# EAGLE design LilyPad_Prototyping_Board (EAGLE 7.4.0)

## Sheet 1 of 2
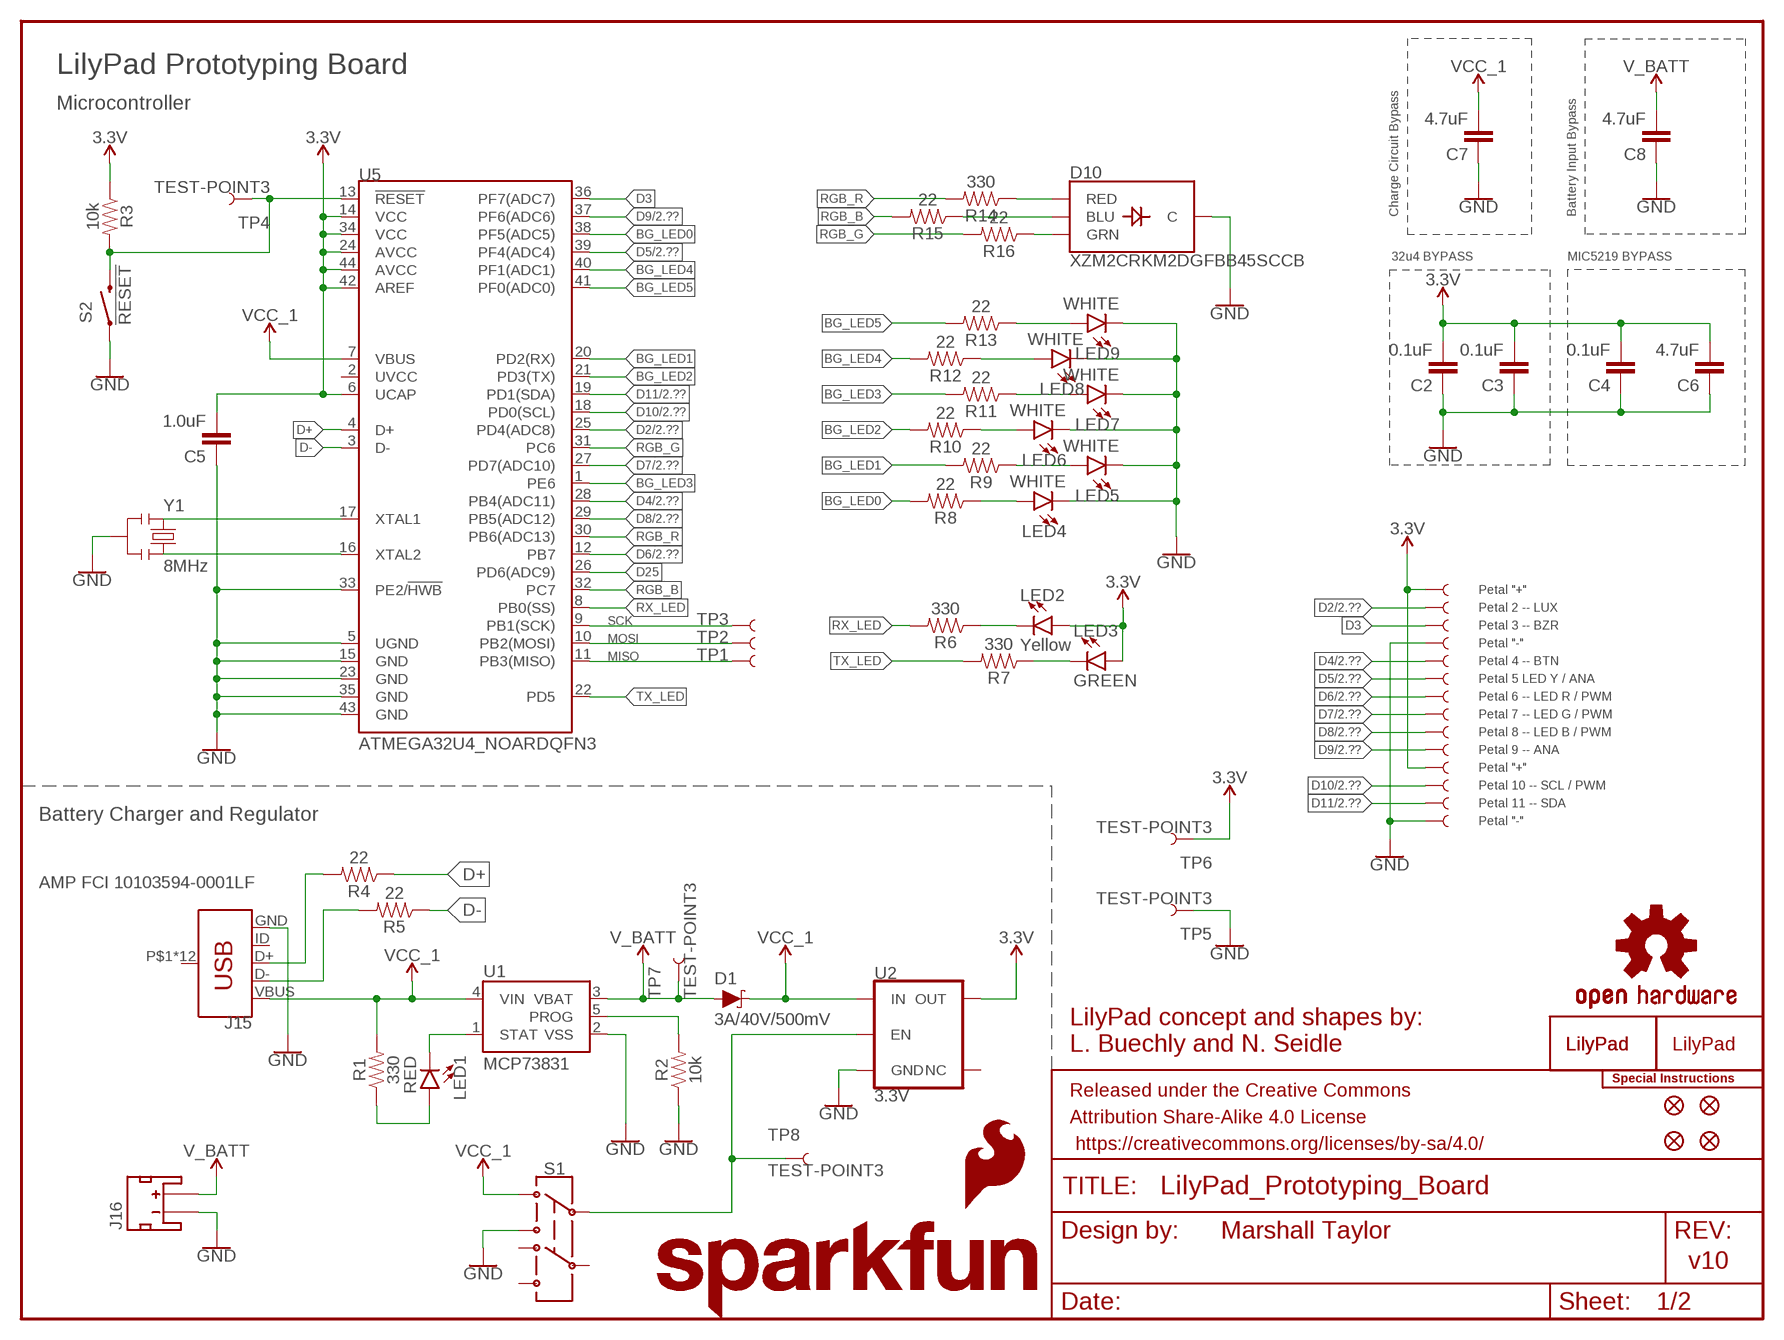
[diagram p0: schematic, sheet 1]

### Parts
C2  0.1uF  0.1UF-0402-16V-10%  [0402]
C3  0.1uF  0.1UF-0402-16V-10%  [0402]
C4  0.1uF  0.1UF-0402-16V-10%  [0402]
C5  1.0uF  1.0UF-0402-16V-10%  [0402]
C6  4.7uF  4.7UF0603  [0603]
C7  4.7uF  4.7UF0603  [0603]
C8  4.7uF  4.7UF0603  [0603]
D1  3A/40V/500mV  DIODE-SCHOTTKY-B340A  [SMA-DIODE]
D10  XZM2CRKM2DGFBB45SCCB  SUNLEDSMD1  [PLCC4SMDLED]
FRAME1  FRAME-LETTER  [CREATIVE_COMMONS]
J1  SEWTAP_LONG-2SIDE  [PETAL-LONG-1-2SIDE]
J2  SEWTAP_LONG-2SIDE  [PETAL-LONG-1-2SIDE]
J3  SEWTAP_LONG-2SIDE  [PETAL-LONG-1-2SIDE]
J4  SEWTAP_LONG-2SIDE  [PETAL-LONG-1-2SIDE]
J5  SEWTAP_LONG-2SIDE  [PETAL-LONG-1-2SIDE]
J6  SEWTAP_LONG-2SIDE  [PETAL-LONG-1-2SIDE]
J7  SEWTAP_LONG-2SIDE  [PETAL-LONG-1-2SIDE]
J8  SEWTAP_LONG-2SIDE  [PETAL-LONG-1-2SIDE]
J9  SEWTAP_LONG-2SIDE  [PETAL-LONG-1-2SIDE]
J10  SEWTAP_LONG-2SIDE  [PETAL-LONG-1-2SIDE]
J11  SEWTAP_LONG-2SIDE  [PETAL-LONG-1-2SIDE]
J12  SEWTAP_LONG-2SIDE  [PETAL-LONG-1-2SIDE]
J13  SEWTAP_LONG-2SIDE  [PETAL-LONG-1-2SIDE]
J14  SEWTAP_LONG-2SIDE  [PETAL-LONG-1-2SIDE]
J15  AMP FCI 10103594-0001LF  USB_MICRO-B_HALF_PTH  [USB-MICROB-PTH]
J16  JST_2MM_MALE  [JST-2-SMD]
JP2  FIDUCIALUFIDUCIAL  [MICRO-FIDUCIAL]
JP3  FIDUCIALUFIDUCIAL  [MICRO-FIDUCIAL]
JP11  FIDUCIALUFIDUCIAL  [MICRO-FIDUCIAL]
JP14  FIDUCIALUFIDUCIAL  [MICRO-FIDUCIAL]
LED1  RED  LED-RED0603  [LED-0603]
LED2  Yellow  LED-YELLOW0603  [LED-0603]
LED3  GREEN  LED-GREEN0603  [LED-0603]
LED4  WHITE  LED-WHITE0603  [LED-0603]
LED5  WHITE  LED-WHITE0603  [LED-0603]
LED6  WHITE  LED-WHITE0603  [LED-0603]
LED7  WHITE  LED-WHITE0603  [LED-0603]
LED8  WHITE  LED-WHITE0603  [LED-0603]
LED9  WHITE  LED-WHITE0603  [LED-0603]
LOGO1  SFE_LOGO_NAME.1_INCH  [SFE_LOGO_NAME_.1]
LOGO2  SFE_LOGO_FLAME.1EXP  [SFE_LOGO_FLAME_COPPER_EXPOSED_.1]
LOGO4  OSHW-LOGOS  [OSHW-LOGO-S]
LOGO5  OSHW-LOGOS  [OSHW-LOGO-S]
LOGO6  OSHW-LOGOS  [OSHW-LOGO-S]
R1  330  330OHM-0603-1/10W-1%  [0603]
R2  10k  10KOHM-0603-1/10W-1%  [0603]
R3  10k  10KOHM-0603-1/10W-1%  [0603]
R4  22  22OHM-0402-1/10W-1%  [0402]
R5  22  22OHM-0402-1/10W-1%  [0402]
R6  330  330OHM-0603-1/10W-1%  [0603]
R7  330  330OHM-0603-1/10W-1%  [0603]
R8  22  22OHM-0402-1/10W-1%  [0402]
R9  22  22OHM-0402-1/10W-1%  [0402]
R10  22  22OHM-0402-1/10W-1%  [0402]
R11  22  22OHM-0402-1/10W-1%  [0402]
R12  22  22OHM-0402-1/10W-1%  [0402]
R13  22  22OHM-0402-1/10W-1%  [0402]
R14  330  330OHM-0603-1/10W-1%  [0603]
R15  22  22OHM-0402-1/10W-1%  [0402]
R16  22  22OHM-0402-1/10W-1%  [0402]
S1  SWITCH-DPDT-SMD-AYZ0202  [SWITCH_DPDT_SMD_AYZ0202]
S2  !RESET  MOMENTARY-SWITCH-SPST-SMD-5.2-REDUNDANT  [TACTILE_SWITCH_SMD_5.2MM]
TP1  TEST-POINT3  [PAD.03X.03]
TP2  TEST-POINT3  [PAD.03X.03]
TP3  TEST-POINT3  [PAD.03X.03]
TP4  TEST-POINT3  [PAD.03X.03]
TP5  TEST-POINT3  [PAD.03X.03]
TP6  TEST-POINT3  [PAD.03X.03]
TP7  TEST-POINT3  [PAD.03X.03]
TP8  TEST-POINT3  [PAD.03X.03]
U1  MCP73831  [SOT23-5]
U2  3.3V  V_REG_AP2112K-3.3V  [SOT23-5]
U5  ATMEGA32U4_NOARDQFN3  [QFN-44-PAD_1:1-LESS_PASTE]
U$1  LILYLOGO_SHORT  [LILYPAD-WEARABLES_LOGO-LILYPAD]
U$13  LILYLOGO_SHORT  [LILYPAD-WEARABLES_LOGO-LILYPAD]
U$43  LILYLOGO_SHORT  [LILYPAD-WEARABLES_LOGO-LILYPAD]
U$44  SPECIAL_INSTRUCTIONS-ORDERING  [ORDERING_INSTRUCTIONS]
U$73  LILYLOGO_ABR  [LILYPAD-WEARABLES_LOGO-L]
Y1  8MHz  RESONATORSMD  [RESONATOR-SMD]

### Nets
3.3V: C2.2 C3.2 C4.2 C5.2 C6.2 J1.1 J11.1 LED2.A LED3.A R3.1 TP6.P$1 U2.5(OUT) U5.6(UCAP) U5.14(VCC) U5.24(AVCC) U5.34(VCC) U5.42(AREF) U5.44(AVCC) ; also sheet 2
BG_LED0: R8.2 U5.38(PF5(ADC5))
BG_LED1: R9.2 U5.20(PD2(RX))
BG_LED2: R10.2 U5.21(PD3(TX))
BG_LED3: R11.2 U5.1(PE6)
BG_LED4: R12.2 U5.40(PF1(ADC1))
BG_LED5: R13.2 U5.41(PF0(ADC0))
D2: J2.1 U5.25(PD4(ADC8)) ; also sheet 2
D3: J3.1 U5.36(PF7(ADC7)) ; also sheet 2
D4: J5.1 U5.28(PB4(ADC11)) ; also sheet 2
D5: J6.1 U5.39(PF4(ADC4)) ; also sheet 2
D6: J7.1 U5.12(PB7) ; also sheet 2
D7: J8.1 U5.27(PD7(ADC10)) ; also sheet 2
D8: J9.1 U5.29(PB5(ADC12)) ; also sheet 2
D9: J10.1 U5.37(PF6(ADC6)) ; also sheet 2
D10: J12.1 U5.18(PD0(SCL)) ; also sheet 2
D11: J13.1 U5.19(PD1(SDA)) ; also sheet 2
D25: U5.26(PD6(ADC9))
D+: R4.1 U5.4(D+)
D-: R5.1 U5.3(D-)
GND: C2.1 C3.1 C4.1 C5.1 C6.1 C7.1 C8.1 D10.4(C) J4.1 J14.1 J15.GND J16.1(-) LED4.C LED5.C LED6.C LED7.C LED8.C LED9.C R2.1 S1.3 S2.1 S2.2 TP5.P$1 U1.2(VSS) U2.2(GND) U5.5(UGND) U5.15(GND) U5.23(GND) U5.33(PE2/!HWB) U5.35(GND) U5.43(GND) Y1.2 ; also sheet 2
MISO: TP1.P$1 U5.11(PB3(MISO))
MOSI: TP2.P$1 U5.10(PB2(MOSI))
N$1: LED2.C R6.1
N$2: S1.2 TP8.P$1 U2.3(EN)
N$3: LED1.A R1.1
N$4: LED1.C U1.1(STAT)
N$5: U5.17(XTAL1) Y1.1
N$6: R2.2 U1.5(PROG)
N$7: U5.16(XTAL2) Y1.3
N$8: D10.2(GRN) R16.1
N$9: LED7.A R11.1
N$10: LED6.A R10.1
N$11: LED5.A R9.1
N$12: LED8.A R12.1
N$13: LED9.A R13.1
N$14: D10.3(BLU) R15.1
N$15: D10.1(RED) R14.1
N$18: LED4.A R8.1
N$19: J15.D- R5.2
N$20: J15.D+ R4.2
N$21: LED3.C R7.1
RESET: R3.2 S2.3 S2.4 TP4.P$1 U5.13(!RESET)
RGB_B: R15.2 U5.32(PC7)
RGB_G: R16.2 U5.31(PC6)
RGB_R: R14.2 U5.30(PB6(ADC13))
RX_LED: R6.2 U5.8(PB0(SS))
SCK: TP3.P$1 U5.9(PB1(SCK))
TX_LED: R7.2 U5.22(PD5)
V_BATT: C8.2 D1.A J16.2(+) TP7.P$1 U1.3(VBAT)
VCC_1: C7.2 D1.C J15.VBUS R1.2 S1.1 U1.4(VIN) U2.1(IN) U5.7(VBUS)
Unconnected: J15.ID J15.P$1(SHIELD) J15.P$2(SHIELD) J15.P$3(SHIELD) J15.P$4(SHIELD) J15.P$6(SHIELD) J15.P$8(SHIELD) J15.P$10(SHIELD) J15.P$12(SHIELD) J15.SHEILD2(SHIELD) J15.SHIELD J15.SHIELD3(SHIELD) J15.SHIELD4(SHIELD) J16.NC1(PAD1) J16.NC2(PAD2) S1.4 S1.5 S1.6 U2.4(NC) U5.2(UVCC)

### Notes on the sheet
- LilyPad Prototyping Board
- Microcontroller
- Charge Circuit Bypass | Battery Input Bypass
- 32u4 BYPASS | MIC5219 BYPASS
- Petal "+"
- Petal 2 -- LUX
- Petal 3 -- BZR
- Petal "-"
- Petal 4 -- BTN
- Petal 5 LED Y / ANA
- Petal 6 -- LED R / PWM
- Petal 7 -- LED G / PWM
- Petal 8 -- LED B / PWM
- Petal 9 -- ANA
- Petal "+"
- Petal 10 -- SCL / PWM
- Petal 11 -- SDA
- Battery Charger and Regulator | Petal "-"
- LilyPad concept and shapes by:
  L. Buechly and N. Seidle
- Marshall Taylor
- v10

## Sheet 2 of 2
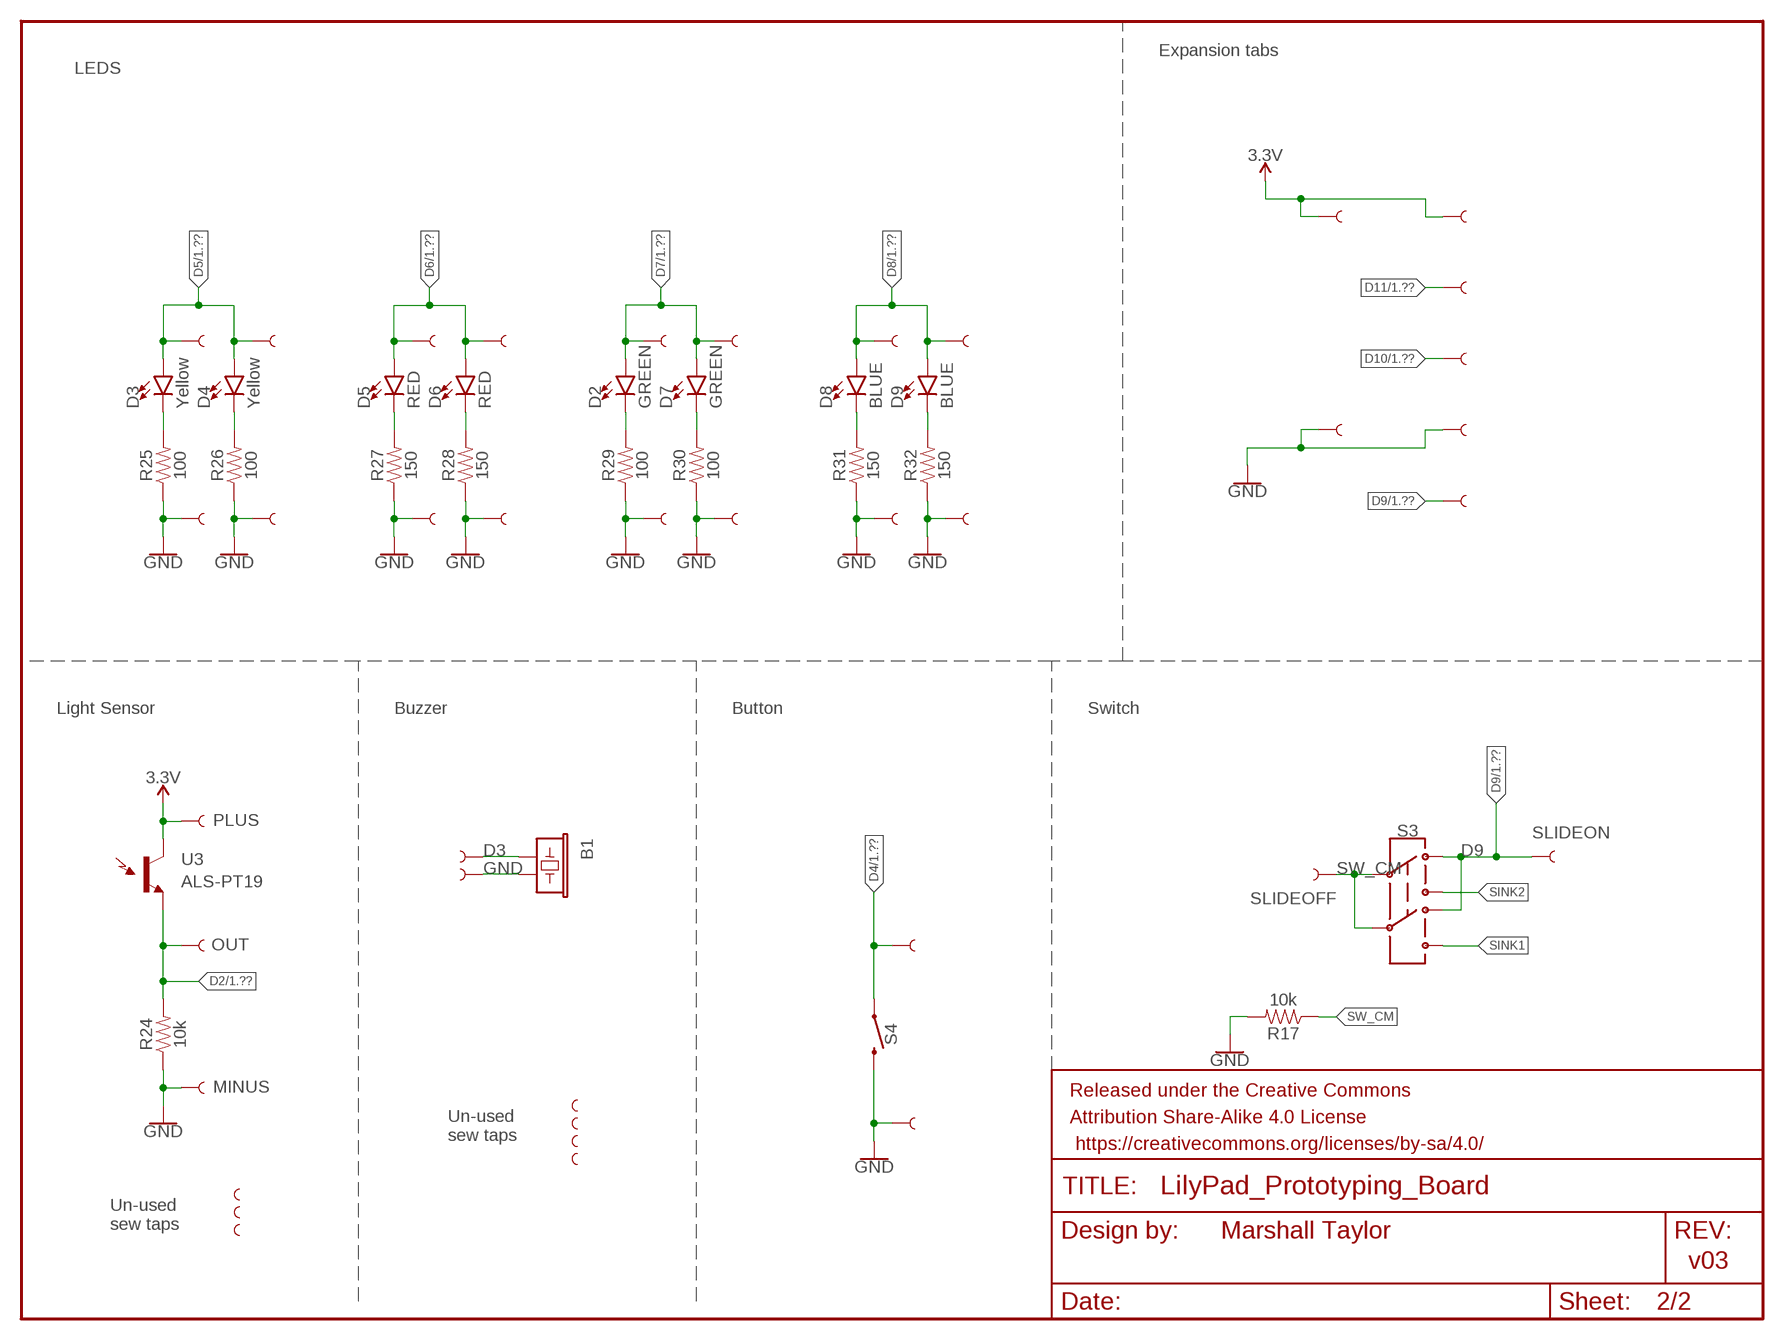
[diagram p1: schematic, sheet 2]

### Parts
B1  Buzzer  BUZZER-SMD  [BUZZER-CCV]
D2  GREEN  LED-GREENLILYPAD  [LED-1206]
D3  Yellow  LED-YELLOWLILYPAD  [LED-1206]
D4  Yellow  LED-YELLOWLILYPAD  [LED-1206]
D5  RED  LED-RED1206  [LED-1206]
D6  RED  LED-RED1206  [LED-1206]
D7  GREEN  LED-GREENLILYPAD  [LED-1206]
D8  BLUE  LED-BLUE1206  [LED-1206]
D9  BLUE  LED-BLUE1206  [LED-1206]
FRAME2  FRAME-LETTERNO_PACKAGE  [DUMMY]
JP1  SEWTAP_SMALL-2SIDE  [PETAL-SMALL-2SIDE]
JP4  SEWTAP_SMALL-2SIDE  [PETAL-SMALL-2SIDE]
JP5  SEWTAP_SMALL-2SIDE  [PETAL-SMALL-2SIDE]
JP6  SEWTAP_SMALL-2SIDE  [PETAL-SMALL-2SIDE]
JP7  SEWTAP_SMALL-2SIDE  [PETAL-SMALL-2SIDE]
JP8  SEWTAP_SMALL-2SIDE  [PETAL-SMALL-2SIDE]
JP9  SEWTAP_SMALL-2SIDE  [PETAL-SMALL-2SIDE]
JP10  SEWTAP_SMALL-2SIDE  [PETAL-SMALL-2SIDE]
JP12  SEWTAP_MEDIUM-2SIDE  [PETAL-MEDIUM-2SIDE]
JP13  SEWTAP_MEDIUM-2SIDE  [PETAL-MEDIUM-2SIDE]
JP20  SEWTAP_SMALL-2SIDE  [PETAL-SMALL-2SIDE]
JP21  SEWTAP_SMALL-2SIDE  [PETAL-SMALL-2SIDE]
JP22  SEWTAP_SMALL-2SIDE  [PETAL-SMALL-2SIDE]
JP23  SEWTAP_SMALL-2SIDE  [PETAL-SMALL-2SIDE]
JP24  SEWTAP_SMALL-2SIDE  [PETAL-SMALL-2SIDE]
JP25  SEWTAP_SMALL-2SIDE  [PETAL-SMALL-2SIDE]
JP26  SEWTAP_SMALL-2SIDE  [PETAL-SMALL-2SIDE]
JP27  SEWTAP_SMALL-2SIDE  [PETAL-SMALL-2SIDE]
R17  10k  10KOHM-0603-1/10W-1%  [0603]
R24  10k  10KOHM-0603-1/10W-1%  [0603]
R25  100  100OHM-0603-1/10W-1%  [0603]
R26  100  100OHM-0603-1/10W-1%  [0603]
R27  150  150OHM-0603-1/10W-1%  [0603]
R28  150  150OHM-0603-1/10W-1%  [0603]
R29  100  100OHM-0603-1/10W-1%  [0603]
R30  100  100OHM-0603-1/10W-1%  [0603]
R31  150  150OHM-0603-1/10W-1%  [0603]
R32  150  150OHM-0603-1/10W-1%  [0603]
S3  SWITCH-DPDT-SMD-AYZ0202  [SWITCH_DPDT_SMD_AYZ0202]
S4  MOMENTARY-SWITCH-SPST-SMD-5.2-REDUNDANT  [TACTILE_SWITCH_SMD_5.2MM]
SEWTAPLS+  PLUS  SEWTAP_SMALL-2SIDE  [PETAL-SMALL-2SIDE]
SEWTAPLS-  MINUS  SEWTAP_SMALL-2SIDE  [PETAL-SMALL-2SIDE]
SEWTAPLSOUT  OUT  SEWTAP_SMALL-2SIDE  [PETAL-SMALL-2SIDE]
SLIDEOFF  SEWTAP_MEDIUM-2SIDE  [PETAL-MEDIUM-2SIDE]
SLIDEON  SEWTAP_MEDIUM-2SIDE  [PETAL-MEDIUM-2SIDE]
ST1  SEWTAP-NOHOLE_SM_NH  [PETAL-SMALL-NOHOLE]
ST2  SEWTAP-NOHOLE_SM_NH  [PETAL-SMALL-NOHOLE]
ST3  SEWTAP-NOHOLE_SM_NH  [PETAL-SMALL-NOHOLE]
U3  ALS-PT19  LIGHT_SENSORALS  [ALS-PT19]
U$35  SEWTAP-NOHOLE_SM_NH  [PETAL-SMALL-NOHOLE]
U$36  SEWTAP-NOHOLE_SM_NH  [PETAL-SMALL-NOHOLE]
U$37  SEWTAP-NOHOLE_SM_NH  [PETAL-SMALL-NOHOLE]
U$38  SEWTAP_SMALL-2SIDE  [PETAL-SMALL-2SIDE]
U$39  SEWTAP_SMALL-2SIDE  [PETAL-SMALL-2SIDE]
U$40  SEWTAP-NOHOLE_SM_NH  [PETAL-SMALL-NOHOLE]
U$41  GATOR_HOLE_PAIR  [GATOR_HOLES]
U$42  GATOR_HOLE_PAIR  [GATOR_HOLES]
U$51/SDA  GATOR_HOLE_PAIR  [GATOR_HOLES]
U$52/SCL  GATOR_HOLE_PAIR  [GATOR_HOLES]
U$52/SCL1  GATOR_HOLE_PAIR  [GATOR_HOLES]
U$53  GATOR_HOLE_PAIR  [GATOR_HOLES]
U$54  GATOR_HOLE_PAIR  [GATOR_HOLES]

### Nets
3.3V: SEWTAPLS+.1 U3.C(C1) U$41.P$1 U$41.P$2 U$42.P$1 U$42.P$2 ; also sheet 1
D2: R24.2 SEWTAPLSOUT.1 U3.E(E1) ; also sheet 1
D3: B1.+ U$39.1 ; also sheet 1
D4: JP12.1 S4.1 S4.2 ; also sheet 1
D5: D3.A D4.A JP20.1 JP22.1 ; also sheet 1
D6: D5.A D6.A JP24.1 JP26.1 ; also sheet 1
D7: D2.A D7.A JP7.1 JP8.1 ; also sheet 1
D8: D8.A D9.A JP9.1 JP10.1 ; also sheet 1
D9: S3.1 S3.4 SLIDEON.1 U$52/SCL1.P$1 U$52/SCL1.P$2 ; also sheet 1
D10: U$52/SCL.P$1 U$52/SCL.P$2 ; also sheet 1
D11: U$51/SDA.P$1 U$51/SDA.P$2 ; also sheet 1
GND: B1.- JP1.1 JP4.1 JP5.1 JP6.1 JP13.1 JP21.1 JP23.1 JP25.1 JP27.1 R17.2 R24.1 R25.1 R26.1 R27.1 R28.1 R29.1 R30.1 R31.1 R32.1 S4.3 S4.4 SEWTAPLS-.1 U$38.1 U$53.P$1 U$53.P$2 U$54.P$1 U$54.P$2 ; also sheet 1
N$41: D3.C R25.2
N$42: D4.C R26.2
N$43: D5.C R27.2
N$44: D6.C R28.2
SINK1: S3.6
SINK2: S3.3
SW_CM: R17.1 S3.2 S3.5 SLIDEOFF.1
X003: D2.C R29.2
X004: D7.C R30.2
X005: D8.C R31.2
X006: D9.C R32.2

### Notes on the sheet
- Expansion tabs
- LEDS
- Light Sensor | Buzzer | Button | Switch
- Un-used
  sew taps
- Un-used
  sew taps
- Marshall Taylor
- v03

## Library data of the parts
B1 = SparkFun-Electromechanical:BUZZER: Buzzer Small round buzzers that operate around the audible 2kHz range. You can use these as speakers to create simple music or user interfaces. Variant Overview: PTH - Mini Speaker - PC Mount 12mm 2.048kHz PTH_KIT - Mini Speaker - PC Mount 12mm 2.048kHz KIT simplifies soldering by adding stop mask to one side of the pads. PTH_NO_SILK - Mini Speaker - PC Mount 12mm 2.048kHz No silkscreen indicator of buzzer outline. PTH_KIT_NO_SILK - Mini Speaker - PC Mount 12mm 2.048kHz KIT package w/o silkscreen SMD - Buzzer Audio Magnetic (CCV-084B16) SMD buzzer used on, e.g. the LilyPad Buzzer and RFID USB Reader. SMD_KIT - Buzzer Audio Magnetic (CCV-084B16) SMD Buzzer with elongated pins to make soldering easier. Used on the SparkFun Simon Says - Surface Mount Soldering Kit.; PROD_ID: COMP-08568
C2-C4 = SparkFun-Capacitors:0.1UF: 0.1µF ceramic capacitors A capacitor is a passive two-terminal electrical component used to store electrical energy temporarily in an electric field.; PROD_ID: CAP-12416
C5 = SparkFun-Capacitors:1.0UF: 1µF ceramic capacitors A capacitor is a passive two-terminal electrical component used to store electrical energy temporarily in an electric field.; PROD_ID: CAP-12417
C6-C8 = SparkFun-Capacitors:4.7UF: 4.7µF ceramic capacitors A capacitor is a passive two-terminal electrical component used to store electrical energy temporarily in an electric field.; PROD_ID: CAP-08280
D1 = SparkFun-DiscreteSemi:DIODE-SCHOTTKY: Schottky diode A Schottky diode is a semiconductor diode which has a low forward voltage drop and a very fast switching action.; PROD_ID: DIO-09886
D2 D7 = SparkFun-LED:LED-GREEN: Green SMD LED Used in manufacturing of various products at SparkFun Packages: 0603 - SMD 0603 package [Product Link] <http://www.futureelectronics.com/en/technologies/semiconductors/optoelectronics/leds/Pages/9894312-LTST-C190GKT.aspx?CrossPart=HSMG-C190&IM=0> LilyPad 1206 - SMD1206 LilyPad package [Product Link] <http://www.futureelectronics.com/en/Technologies/Product.aspx?ProductID=IN150NGHARVATEKCORPORATION2049943&IM=0> 1206 - SMD1206 package [Product Link] <http://www.futureelectronics.com/en/technologies/semiconductors/optoelectronics/leds/Pages/8315665-LTST-C150KGKT.aspx?IM=0> 1206 Bottom Mount -SMD 1206 Bottom Mount [Product Link] <http://www.digikey.com/product-detail/en/lite-on-inc/LTST-C230KGKT/160-1456-1-ND/386854> SparkFun Products: Pro Mini 328 -5V <https://www.sparkfun.com/products/821> RedBoard <https://www.sparkfun.com/products/12757> MP3 Trigger <https://www.sparkfun.com/products/13720> Makey Makey <https://www.sparkfun.com/products/11076>; PROD_ID: DIO-09910
D3 D4 = SparkFun-LED:LED-YELLOW: Yellow SMD LED Used in manufacturing several products at SparkFun. Packages: 0603 - SMD 0603 package[Product Link] <http://www.kingbrightusa.com/product.asp?catalog_name=LED&product_id=APT1608SYCK> 0603 -SMART - SMART SMD 0603 package (more efficient/more expensive) [Product Link] <http://www.osram-os.com/osram_os/en/products/product-catalog/led-light-emitting-diodes/smartled-0603/ly-l29k/index.jsp> LilyPad - SMD1206 package[Product Datasheet] <https://www.sparkfun.com/datasheets/DevTools/LilyPad/Q150YUS4.pdf> SparkFun Products: Blynk Board <https://www.sparkfun.com/products/13794> IOIO-OTG <https://www.sparkfun.com/products/13613> XBee Explorer Serial <https://www.sparkfun.com/products/13225>; PROD_ID: DIO-09909
D5 D6 = SparkFun-LED:LED-RED: Red SMD LED Used in manufacturing of most products at SparkFun Packages: 0603 - SMD 0603 package [Product Link] <http://docs.avagotech.com/docs/AV02-0551EN> 0603 SMART - SMD 0603 SMART package ( more efficient and expensive)[Product Link] <http://www.osram-os.com/Graphics/XPic2/00077099_0.pdf> 1206 - SMD1206 package [Product Link] <https://www.sparkfun.com/datasheets/DevTools/LilyPad/Q150OVS4.pdff> SparkFun Products: Pro Mini 328 -5V <https://www.sparkfun.com/products/821> RedBoard <https://www.sparkfun.com/products/12757> IOIO-OTG <https://www.sparkfun.com/products/13613>; PROD_ID: DIO-09912
D8 D9 = SparkFun-LED:LED-BLUE: Blue SMD LED Used in manufacturing of various products at SparkFun Packages: 0603 - SMD 0603 package [Product Link] <http://www.digikey.com/product-detail/en/SMLE12BC7TT86/511-1589-2-ND/1641808> 1206 - SMD1206 package [Product Link] <http://www.digikey.com/product-detail/en/lite-on-inc/LTST-C150TBKT/160-1643-1-ND/573584> SparkFun Products: ESP8266 Thing-Dev Board <https://www.sparkfun.com/products/13711> RedBoard <https://www.sparkfun.com/products/12757>; PROD_ID: DIO-09911
D10 = newLilypadParts:SUNLED: LED-RGB Common Cathode XZM2CRKM2DGFBB45SCCB Packages: PLCC4 SparkFun Products: Lilypad Prototyping Board <[https://www.sparkfun.com/products/9264]>; PROD_ID: DIO-13722
FRAME1 = SparkFun-Aesthetics:FRAME-LETTER: Schematic Frame - Letter Standard 8.5x11 US Letter frame
FRAME2 = SparkFun-Aesthetics:FRAME-LETTER: Schematic Frame - Letter Standard 8.5x11 US Letter frame; DESIGNER: Nobody; VERSION: v01
J1-J14 JP1 JP4-JP10 JP12 JP13 JP20-JP27 SEWTAPLS+ SEWTAPLS- SEWTAPLSOUT SLIDEOFF SLIDEON U$38 U$39 = LilyPad-Wearables:SEWTAP: SparkFun LilyPad Sew Taps Sewable connection points for LilyPad Boards SparkFun Products: LilyPad Arduino 328 Main Board <https://www.sparkfun.com/products/13342> LilyTiny <https://www.sparkfun.com/products/10899> LilyPad Power Supply <https://www.sparkfun.com/products/11259>
J15 = SparkFun-Connectors:USB_MICRO-B: USB Type Micro-B Connector Male/female and PTH/SMT variants SparkFun Products: SparkFun microB USB Breakout <https://www.sparkfun.com/products/12035> SparkFun USB microB Plug Breakout <https://www.sparkfun.com/products/10031> SparkFun ESP8266 Thing <https://www.sparkfun.com/products/13231>; PROD_ID: CONN-13711
J16 = SparkFun-Connectors:JST_2MM_MALE: JST 2MM MALE RA CONNECTOR Two pin, compact surface mount connector. Commonly used as a battery input connection point. We really like the solid locking feeling and high current rating on these small connectors. We use these all the time as battery connectors. Mates to single-cell LiPo batteries. Here is the connector we sell at SparkFun: JST Right Angle Connector - White (PRT-08612) Datasheet It was used on these SparkFun products: SparkFun MOSFET Power Controller (PRT-11214) SparkFun Battery Babysitter - LiPo Battery Manager (PRT-13777) And many, many others that required a lipo battery connection.; PROD_ID: CONN-11443; SF_ID: PRT-08612
JP2 JP3 JP11 JP14 = SparkFun:FIDUCIAL: Fiducial Alignment Points Various fiducial points for machine vision alignment.
LED1 = SparkFun-LED:LED-RED: Red SMD LED Used in manufacturing of most products at SparkFun Packages: 0603 - SMD 0603 package [Product Link] <http://docs.avagotech.com/docs/AV02-0551EN> 0603 SMART - SMD 0603 SMART package ( more efficient and expensive)[Product Link] <http://www.osram-os.com/Graphics/XPic2/00077099_0.pdf> 1206 - SMD1206 package [Product Link] <https://www.sparkfun.com/datasheets/DevTools/LilyPad/Q150OVS4.pdff> SparkFun Products: Pro Mini 328 -5V <https://www.sparkfun.com/products/821> RedBoard <https://www.sparkfun.com/products/12757> IOIO-OTG <https://www.sparkfun.com/products/13613>; PROD_ID: DIO-00819
LED2 = SparkFun-LED:LED-YELLOW: Yellow SMD LED Used in manufacturing several products at SparkFun. Packages: 0603 - SMD 0603 package[Product Link] <http://www.kingbrightusa.com/product.asp?catalog_name=LED&product_id=APT1608SYCK> 0603 -SMART - SMART SMD 0603 package (more efficient/more expensive) [Product Link] <http://www.osram-os.com/osram_os/en/products/product-catalog/led-light-emitting-diodes/smartled-0603/ly-l29k/index.jsp> LilyPad - SMD1206 package[Product Datasheet] <https://www.sparkfun.com/datasheets/DevTools/LilyPad/Q150YUS4.pdf> SparkFun Products: Blynk Board <https://www.sparkfun.com/products/13794> IOIO-OTG <https://www.sparkfun.com/products/13613> XBee Explorer Serial <https://www.sparkfun.com/products/13225>; PROD_ID: DIO-09003
LED3 = SparkFun-LED:LED-GREEN: Green SMD LED Used in manufacturing of various products at SparkFun Packages: 0603 - SMD 0603 package [Product Link] <http://www.futureelectronics.com/en/technologies/semiconductors/optoelectronics/leds/Pages/9894312-LTST-C190GKT.aspx?CrossPart=HSMG-C190&IM=0> LilyPad 1206 - SMD1206 LilyPad package [Product Link] <http://www.futureelectronics.com/en/Technologies/Product.aspx?ProductID=IN150NGHARVATEKCORPORATION2049943&IM=0> 1206 - SMD1206 package [Product Link] <http://www.futureelectronics.com/en/technologies/semiconductors/optoelectronics/leds/Pages/8315665-LTST-C150KGKT.aspx?IM=0> 1206 Bottom Mount -SMD 1206 Bottom Mount [Product Link] <http://www.digikey.com/product-detail/en/lite-on-inc/LTST-C230KGKT/160-1456-1-ND/386854> SparkFun Products: Pro Mini 328 -5V <https://www.sparkfun.com/products/821> RedBoard <https://www.sparkfun.com/products/12757> MP3 Trigger <https://www.sparkfun.com/products/13720> Makey Makey <https://www.sparkfun.com/products/11076>; PROD_ID: DIO-00819
LED4-LED9 = SparkFun-LED:LED-WHITE: White SMD LED Used in manufacturing several products at SparkFun. Packages: 0603 - Bright White SMD 0603 package[Product Link] <http://www.kingbrightusa.com/product.asp?catalog_name=LED&product_id=APT1608QWF/D> 1206 - Bright White SMD1206 package [Product Link] <http://www.kingbrightusa.com/product.asp?catalog_name=LED&product_id=APT3216QWF/D> SparkFun Products: Blackberry Trackballer Breakout <https://www.sparkfun.com/products/13169> Digital SandBox <https://www.sparkfun.com/products/12651>; PROD_ID: DIO-09004
LOGO1 = SparkFun-Aesthetics:SFE_LOGO_NAME: SparkFun Font Logo This is the SparkFun name logo. The logo on the schematic will always be the same size; the package variant is the height of the flame part of the logo (or the height the flame would be, if it were drawn). Default layer for the logo on the board is tSilk.
LOGO2 = SparkFun-Aesthetics:SFE_LOGO_FLAME: SparkFun Flame Logo This is the SparkFun flame logo. The logo on the schematic will always be the same size; the package variant is the height of the flame. Default layer for the logo on the board is tSilk.
LOGO4-LOGO6 = SparkFun-Aesthetics:OSHW-LOGO: Open-Source Hardware (OSHW) Logo This logo indicates the piece of hardware it is found on incorporates a OSHW license and/or adheres to the definition of open source hardware found here: http://freedomdefined.org/OSHW
R1 R6 R7 R14 = SparkFun-Resistors:330OHM: 330Ω resistor A resistor is a passive two-terminal electrical component that implements electrical resistance as a circuit element. Resistors act to reduce current flow, and, at the same time, act to lower voltage levels within circuits. - Wikipedia; PROD_ID: RES-00818
R2 R3 R17 R24 = SparkFun-Resistors:10KOHM: 10kΩ resistor A resistor is a passive two-terminal electrical component that implements electrical resistance as a circuit element. Resistors act to reduce current flow, and, at the same time, act to lower voltage levels within circuits. - Wikipedia; PROD_ID: RES-00824
R4 R5 R8-R13 R15 R16 = SparkFun-Resistors:22OHM: 22Ω resistor A resistor is a passive two-terminal electrical component that implements electrical resistance as a circuit element. Resistors act to reduce current flow, and, at the same time, act to lower voltage levels within circuits. - Wikipedia; PROD_ID: RES-12427
R25 R26 R29 R30 = SparkFun-Resistors:100OHM: 100Ω resistor A resistor is a passive two-terminal electrical component that implements electrical resistance as a circuit element. Resistors act to reduce current flow, and, at the same time, act to lower voltage levels within circuits. - Wikipedia; PROD_ID: RES-07863
R27 R28 R31 R32 = SparkFun-Resistors:150OHM: 150Ω resistor A resistor is a passive two-terminal electrical component that implements electrical resistance as a circuit element. Resistors act to reduce current flow, and, at the same time, act to lower voltage levels within circuits. - Wikipedia; PROD_ID: RES-11028
S1 S3 = SparkFun-Switches:SWITCH-DPDT: Double-Pole, Double-Throw (DPDT) Switch Double-pole, double-throw switches. Variant Overview PTH-GPI-152-3013 Used on SparkFun Geiger Counter SMD-AY0202 Surface Mount DPDT Switch (COM-00597) Used on e.g. LilyPad Arduino USB - ATmega32U4 Board; PROD_ID: SWCH-08179; SF_SKU: COM-00597
S2 S4 = SparkFun-Switches:MOMENTARY-SWITCH-SPST: Momentary Switch (Pushbutton) - SPST Normally-open (NO) SPST momentary switches (buttons, pushbuttons). Variants PTH-12MM - 12mm square, through-hole Momentary Pushbutton Switch - 12mm Square (COM-09190) PTH-6.0MM, PTH-6.0MM-KIT - 6.0mm square, through-hole Mini Pushbutton Switch (COM-00097) KIT package intended for soldering kit's - only one side of pads' copper is exposed. PTH-RIGHT-ANGLE-KIT - Right-angle, through-hole Right Angle Tactile Button - Used on SparkFun BigTime Watch Kit SMD-12MM - 12mm square, surface-mount Tactile Button - SMD (12mm) (COM-12993) Used on SparkFun PicoBoard SMD-4.5MM - 4.5mm Square Trackball Switch Used on SparkFun Blackberry Trackballer Breakout SMD-4.6MMX2.8MM - 4.60mm x 2.80mm, surface mount Used on SparkFun SAMD21 Mini Breakout SMD-5.2MM, SMD-5.2-REDUNDANT - 5.2mm square, surface-mount Mini Pushbutton Switch - SMD (COM-08720) Used on Arduino Pro Mini REDUNDANT package connects both switch circuits together SMD-6.0X3.5MM - 6.0 x 3.5mm, surface mount Momentary Reset Switch SMD (COM-08229) SMD-6.2MM-TALL - 6.2mm square, surface mount Tactile Button - SMD (6mm) Used on SparkFun Digital Sandbox SMD-RIGHT-ANGLE - Right-angle, surface mount Used on SparkFun Block for Intel® Edison - Arduino; PROD_ID: SWCH-08247; SF_SKU: COM-08720
ST1-ST3 U$35-U$37 U$40 = LilyPad-Wearables:SEWTAP-NOHOLE: SparkFun LilyPad Sew Taps without Holes Petals used for PCB aesthetics. No connection points for circuits, and no hole available for sewing. SparkFun Products: LilyPad Vibe Board <https://www.sparkfun.com/products/11008> LilyPad Accelerometer <https://www.sparkfun.com/products/9267> LilyPad Buzzer <https://www.sparkfun.com/products/8463>
TP1-TP8 = SparkFun-Connectors:TEST-POINT: SparkFun Test Points Bare copper test points for troubleshooting or In-Circuit-Testing. These are used by our Production team for verifying production board runs using pogo-pins on test beds. SparkFun Products: SparkFun LSM9DS1 Breakout <https://www.sparkfun.com/products/13284> SparkFun PSOC <https://www.sparkfun.com/products/13714> SparkFun Load Cell Amplifier <https://www.sparkfun.com/products/13879>
U1 = SparkFun-PowerIC:MCP73831: Miniature single cell, fully integrated Li-Ion, Li-polymer charge management controller http://ww1.microchip.com/downloads/en/DeviceDoc/21984a.pdf; PROD_ID: IC-09995
U2 = SparkFun-IC-Power:V_REG_AP2112: AP2112 - 600mA CMOS LDO Regulator w/ Enable The AP2112 is CMOS process low dropout linear regulator with enable function, the regulator delivers a guaranteed 600mA (min.) continuous load current. Features Output Voltage Accuracy: ±1.5% Output Current: 600mA (Min.) Foldback Short Current Protection: 50mA Enable Function to Turn ON/OFF VOUT Low Dropout Voltage (3.3V): 250mV (Typ.) @IOUT=600mA Excellent Load Regulation: 0.2%/A (Typ.) Excellent Line Regulation: 0.02%/V (Typ.) Low Quiescent Current: 55μA (Typ.) Low Standby Current: 0.01μA (Typ.) Low Output Noise: 50μVRMS PSRR: 100Hz -65dB, 1kHz -65dB OTSD Protection Stable with 1.0μF Flexible Cap: Ceramic, Tantalum and Aluminum Electrolytic Operation Temperature Range: -40°C to 85°C ESD: MM 400V, HBM 4000V; PROD_ID: VREG-12457
U3 = SparkFun-Sensors:LIGHT_SENSOR: Ambient Light Sensors - Phototransistors Low cost ambient light sensors, consisting of a phototransistor in miniature SMD packages. Output voltage varies with light intensity. SparkFun Products ALS-PT19 Light Sensor (SEN-12566) Ambient Light Sensor - TEMT6000 (SEN-08348) SparkFun Ambient Light Sensor Breakout - TEMT60000 (SEN-08688); PROD_ID: IC-11836; SF_ID: SEN-12566
U5 = newLilypadParts:ATMEGA32U4_NOARD: Atmel MCU, 32KByte Atmel 44-pin 8-bit Microcontroller with 32KBytes of ISP Flash and USB Controller Datasheet SparkFun Products LilyPad Arduino USB - ATmega32U4 Board (DEV-12049) Pro Micro - 5V/16MHz (DEV-12640) Pro Micro - 3.3V/8MHz (DEV-12587) Fio v3 - ATmega32U4 (DEV-11520) Qduino Mini (DEV-13614) Makey Makey - Standard Kit (WIG-11511) Makey Makey Deluxe Kit (WIG-11519)
U$1 U$13 U$43 = newLilypadParts:LILYLOGO_SHORT
U$41 U$42 U$51/SDA U$52/SCL U$52/SCL1 U$53 U$54 = newLilypadParts:GATOR_HOLE_PAIR
U$44 = SparkFun-Aesthetics:SPECIAL_INSTRUCTIONS: Special Ordering/Production Instructions Alert Symbol for special PCB ordering instructions or unique production process warnings. Ordering Instructions Production Instructions Types of information that should be added to box: Copper weight Soldermask color Silk color PCB thickness Number of layers PCB Standard: 1.6mm FR4 1 oz copper immersion silver plating red soldermask white silkscreen Types of information that should be added to box: Special wash requirements Depaneling instructions Humidification Glue curing Default text settings: 0.07 inch 9% ratio 50% line distance
U$73 = newLilypadParts:LILYLOGO_ABR
Y1 = SparkFun-FreqCtrl:RESONATOR: Resonator Small SMD resonator. This is the itty bitty 10/20MHz resonators with built in caps. CSTCE10M0G55 and CSTCE20M0V53. Footprint has been reviewed closely but hasn't been tested yet.; PROD_ID: XTAL-08895

## Board
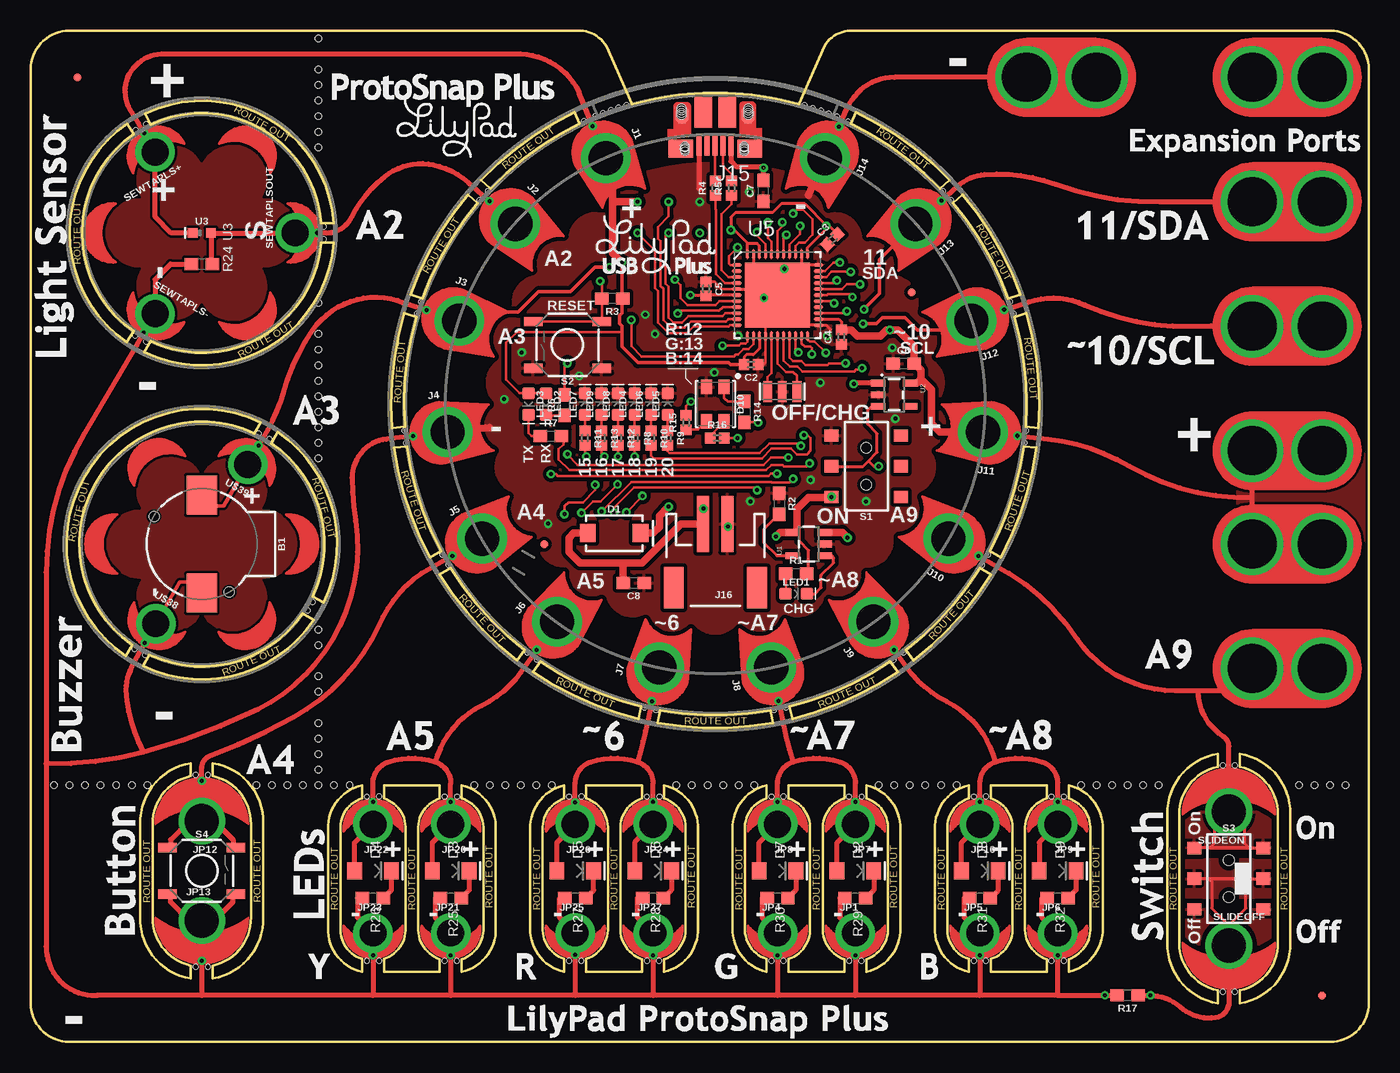
[diagram p2: board, top side]
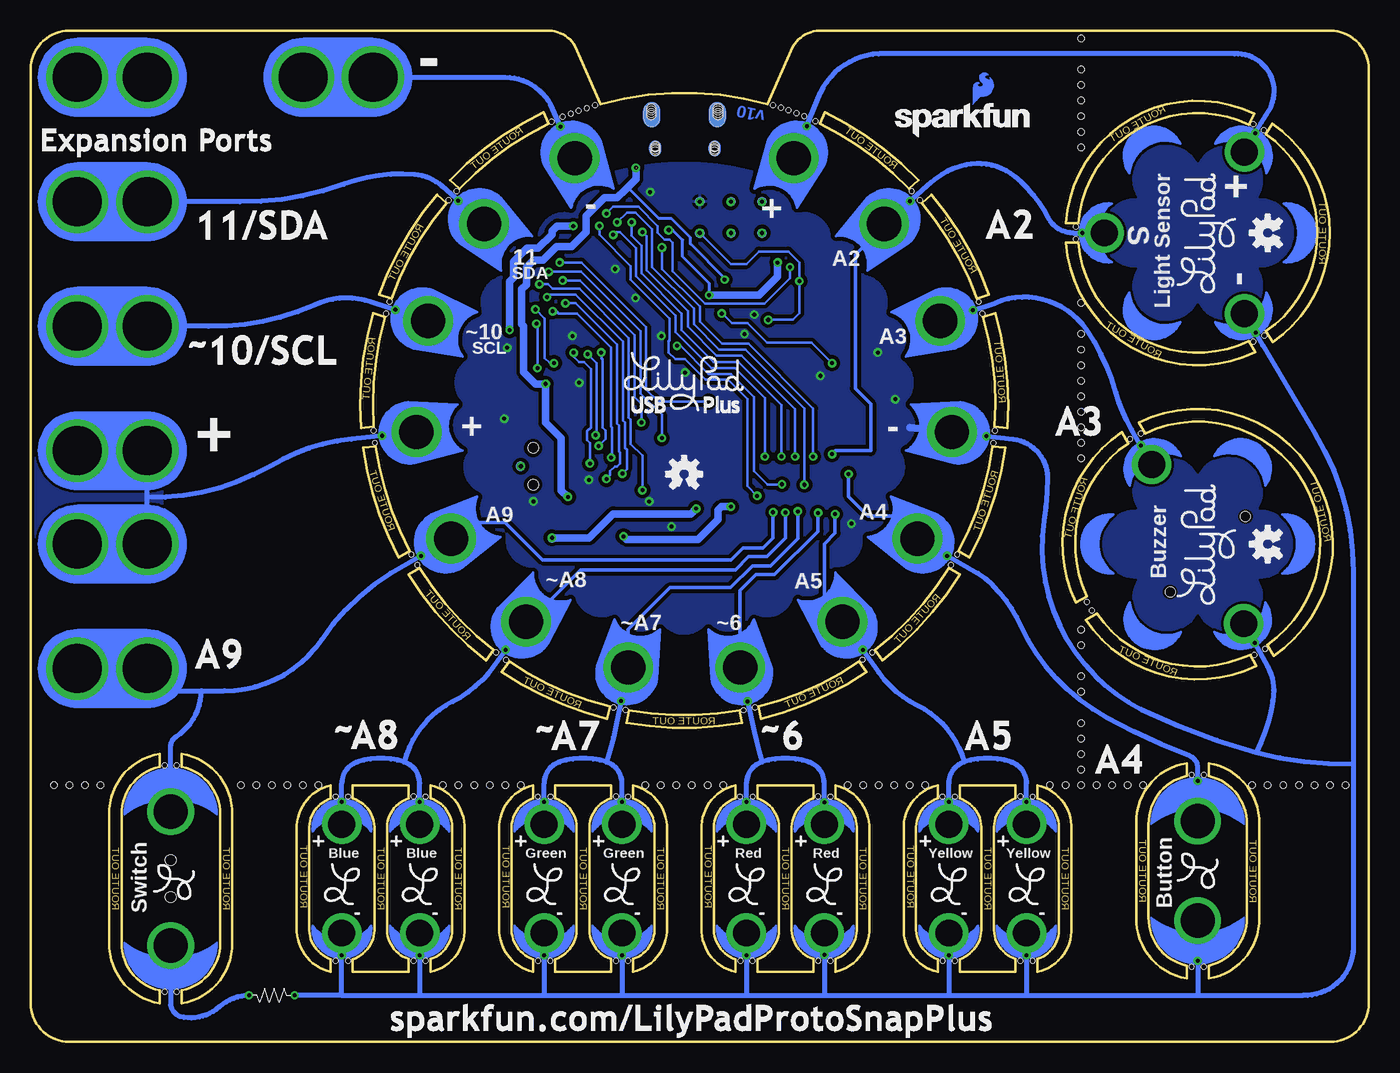
[diagram p3: board, bottom side, seen from below]

Size 109.22 x 82.55 mm. Coordinates in mm from the lower left corner, seen from the top.
Outline: 234 segments
Copper layers (1*16): Top 0.035mm / dielectric 1.5mm / Bottom 0.035mm
Design rules "SparkFun-2-layer-TIGHT *": minimum track width 7mil, minimum drill 15mil, track to track 8mil, track to pad 8mil, pad to pad 8mil, via to via 8mil, smd to smd 8mil, copper to edge 7mil, drill to drill 7mil, minimum pad ring 7mil, minimum via ring 7mil, stop-mask expansion 4mil, vias tented up to drill 25mil, thermal gap 10mil
Holes 0.38 mm at 23.92,66.54 23.93,65.54 8.57,74.41 9.44,74.91 9.42,57.16 8.55,57.67 14.47,6.13 13.47,6.13 14.47,21.81 13.47,21.81 33.77,20.03 34.81,20.03 33.79,6.64 34.79,6.64 27.44,20.03 28.44,20.03 27.44,6.64 28.44,6.64 8.47,32.07 9.33,31.58 18.6,49.68 19.48,49.21 22.6,35.22 23,35.92 37.32,69.44 36.64,68.71 31.85,60.41 31.54,59.46 30.54,49.92 30.63,48.9 34.1,38.92 33.6,39.79 40.54,31.78 41.33,31.2 50.09,27.3 51.04,27.08 60.67,27.09 61.65,27.3 70.42,31.19 71.23,31.79 77.66,38.92 78.15,39.8 81.12,48.91 81.23,49.91 80.21,59.47 79.92,60.42 74.45,69.45 75.12,68.7 66.7,75.1 65.79,75.51 65.13,75.76 64.49,76.01 63.16,76.45 63.83,76.23 45.16,75.15 46.09,75.57 46.73,75.82 47.36,76.05 48,76.27 48.64,76.47 98.29,4.1 97.29,4.1 97.29,22.57 98.29,22.57 50.28,20.03 51.32,20.03 50.3,6.64 51.3,6.64 43.95,20.03 44.95,20.03 43.95,6.64 44.95,6.64 66.79,20.03 67.83,20.03 66.81,6.64 67.81,6.64 60.46,20.03 61.46,20.03 60.46,6.64 61.46,6.64 83.3,20.03 84.34,20.03 83.32,6.64 84.32,6.64 76.97,20.03 77.97,20.03 76.97,6.64 77.97,6.64
Holes 0.51 mm at 23.5,24.77 23.5,23.5 23.5,22.23 23.5,20.96 38.73,20.96 40.01,20.96 55.25,20.96 56.52,20.96 71.75,20.96 73.03,20.96 88.27,20.96 20.96,20.96 22.23,20.96 18.41,20.96 19.69,20.96 89.53,20.96 90.81,20.96 92.08,20.96 103.5,20.96 104.78,20.96 106.05,20.96 107.31,20.96 9.53,20.96 8.26,20.96 6.98,20.96 5.72,20.96 4.45,20.96 23.5,26.04 23.5,28.57 23.5,29.84 23.5,32.39 23.5,33.66 23.5,47.62 23.5,48.9 23.5,50.16 23.5,52.7 23.5,53.98 23.5,51.44 23.5,55.24 23.5,56.52 23.5,57.78 23.5,73.03 23.5,74.3 23.5,75.56 23.5,76.84 23.5,78.11 23.5,79.38 75.56,20.96 70.48,20.96 87,20.96 85.72,20.96 74.3,20.96 69.22,20.96 59.05,20.96 57.79,20.96 53.98,20.96 52.71,20.96 42.55,20.96 41.28,20.96 37.47,20.96 36.2,20.96 26.04,20.96 24.77,20.96 3.18,20.96 1.91,20.96 23.5,60.33 23.5,81.91
tRestrict: area 19,60.7 to 24.1,71.4; area 14,69 to 23.1,76.4; area 4.8,69 to 14,76.4; area 3.8,60.7 to 8.9,71.1; area 4.8,55.4 to 14,63.1; area 14,55.4 to 23.1,63.1; area 48.8,71.5 to 62.9,77.2; area 14,43.6 to 23.1,51; area 19,35.3 to 24.1,46; area 14,30 to 23.1,37.7; area 4.8,30 to 14,37.7; area 3.8,35.3 to 8.9,45.7; 1 more areas; 1 lines
bRestrict: area 48.8,71.5 to 62.9,77.2; area 19,60.7 to 24.1,71.4; area 14,69 to 23.1,76.4; area 4.8,69 to 14,76.4; area 3.8,60.7 to 8.9,71.1; area 4.8,55.4 to 14,63.1; area 14,55.4 to 23.1,63.1; area 14,43.6 to 23.1,51; area 19,35.3 to 24.1,46; area 14,30 to 23.1,37.7; area 4.8,30 to 14,37.7; area 3.8,35.3 to 8.9,45.7; 1 more areas; 1 lines

### Footprints (pad centres in the part's own frame; a part is rotated, then mirrored left to right if it is on the bottom)
BUZZER-CCV = smd 3.2 x 2.5: + 4,0; - -4,0 | hole 0.8: -3.9,-2.25; 2.25,3.9
0402 = smd 0.85 x 0.9: 1 -0.58,0; 2 0.58,0
0603 = smd 1.1 x 1: 1 -0.85,0; 2 0.85,0
SMA-DIODE = smd 1.27 x 1.47: A -2.15,0; C 2.15,0
LED-1206 = smd 1.2 x 1.4: A -1.5,0; C 1.5,0
PLCC4SMDLED = smd 1.2 x 0.9: 1 -1.4,0.725; 2 1.4,0.725; 3 1.4,-0.725; 4 -1.4,-0.725
PETAL-LONG-1-2SIDE = drill 2.794 pad 4.064: 1 0.03,0
USB-MICROB-PTH = smd 0.4 x 1.75: D+ 0.031,1.331; D- -0.619,1.331; GND 1.331,1.331; ID 0.681,1.331; VBUS -1.269,1.331 | smd 1.4 x 2.1 bottom: P$1 2.701,-1.142; P$3 -2.659,-1.144 | smd 1 x 1.3: P$2 2.487,1.594; P$6 -2.368,1.604 | smd 1 x 1.3 bottom: P$4 -2.368,1.604; P$10 2.481,1.598 | smd 1.1 x 1.5: P$8 2.701,-1.142; P$12 -2.659,-1.144 | smd 2 x 1.46: SHEILD2 2.831,1.606; SHIELD -2.794,1.606 | smd 1.425 x 2.5: SHIELD3 -0.979,-1.349; SHIELD4 0.996,-1.352 | hole 0.7: -2.693,-1.134; -2.693,-1.3; -2.694,-1.499; -2.694,-1.664; 2.768,-1.134; 2.767,-1.303; 2.766,-1.496; 2.766,-1.664 | hole 0.66: -2.359,1.821; -2.349,1.691; -2.359,1.541; -2.354,1.432; 2.481,1.821; 2.491,1.691; 2.481,1.541; 2.486,1.432
JST-2-SMD = smd 1 x 4.6: 1 -1,-3.7; 2 1,-3.7 | smd 1.6 x 3.4: NC1 -3.4,1.5; NC2 3.4,1.5
PETAL-SMALL-2SIDE = drill 2.2: 1 0,0
MICRO-FIDUCIAL = smd 0.635 x 0.635: 1 0,0
PETAL-MEDIUM-2SIDE = drill 2.794: 1 0,-0.254
LED-0603 = smd 1 x 1: A -0.877,0; C 0.877,0
SWITCH_DPDT_SMD_AYZ0202 = smd 1 x 1.15: 1 -2.5,2.825; 2 0,2.825; 3 2.5,2.825; 4 -2.5,-2.825; 5 0,-2.825; 6 2.5,-2.825 | hole 0.85: 1.5,0; -1.5,0
TACTILE_SWITCH_SMD_5.2MM = smd 1.524 x 0.762: 1 -2.794,1.905; 2 2.794,1.905; 3 -2.794,-1.905; 4 2.794,-1.905
PAD.03X.03 = smd 0.762 x 0.762: P$1 0,0
SOT23-5 = smd 0.55 x 1.2: 1 -0.95,-1.3; 2 0,-1.3; 3 0.95,-1.3; 4 0.95,1.3; 5 -0.95,1.3
ALS-PT19 = smd 0.8 x 0.8: C -0.75,0; E 0.75,0
QFN-44-PAD_1:1-LESS_PASTE = smd 0.8 x 0.3: 1 -3.337,2.458; 2 -3.337,1.958; 3 -3.337,1.479; 4 -3.337,0.979; 5 -3.337,0.5; 6 -3.337,0; 7 -3.337,-0.5; 8 -3.337,-0.979; 9 -3.337,-1.479; 10 -3.337,-1.958; 11 -3.337,-2.458; 23 3.337,-2.458; 24 3.337,-1.958; 25 3.337,-1.479; 26 3.337,-0.979; 27 3.337,-0.5; 28 3.337,0; 29 3.337,0.5; 30 3.337,0.979; 31 3.337,1.479; 32 3.337,1.958; 33 3.337,2.458 | smd 0.3 x 0.8: 12 -2.458,-3.337; 13 -1.958,-3.337; 14 -1.479,-3.337; 15 -0.979,-3.337; 16 -0.5,-3.337; 17 0,-3.337; 18 0.5,-3.337; 19 0.979,-3.337; 20 1.479,-3.337; 21 1.958,-3.337; 22 2.458,-3.337; 34 2.458,3.337; 35 1.958,3.337; 36 1.479,3.337; 37 0.979,3.337; 38 0.5,3.337; 39 0,3.337; 40 -0.5,3.337; 41 -0.979,3.337; 42 -1.479,3.337; 43 -1.958,3.337; 44 -2.458,3.337 | smd 5.3 x 5.3: EPAD 0,0
GATOR_HOLES = drill 4 pad 5.08: P$1 0,0; P$2 5.715,0
RESONATOR-SMD = smd 0.7 x 1.7: 1 -1.2,0; 2 0,0; 3 1.2,0

### Placement (x,y rotation side)
B1  13.97,40.64 90 top
C2  58.8,55.29 180 top
C3  65.44,65.52 45 top
C4  66.17,57.53 90 top
C5  55.12,61.47 270 top
C6  71.25,55.37 0 top
C7  59.82,69.47 90 top
C8  49.21,37.47 180 top
D1  47.63,41.53 0 top
D2  67.31,13.97 0 top
D3  34.29,13.97 0 top
D4  27.94,13.97 0 top
D5  44.45,13.97 0 top
D6  50.8,13.97 0 top
D7  60.96,13.97 0 top
D8  77.47,13.97 0 top
D9  83.82,13.97 0 top
D10  55.88,52.07 270 top
FRAME1  20.7,-11.43 0 top  (outside the outline)
FRAME2  5.08,-16.51 0 top  (outside the outline)
J1  46.93,72.17 294 top
J2  39.53,66.79 318 top
J3  34.96,58.87 342 top
J4  34,49.77 6 top
J5  36.83,41.07 30 top
J6  42.95,34.27 54 top
J7  51.31,30.55 78 top
J8  60.45,30.55 102 top
J9  68.81,34.27 126 top
J10  74.93,41.07 150 top
J11  77.76,49.77 174 top
J12  76.8,58.87 198 top
J13  72.23,66.79 222 top
J14  64.83,72.17 246 top
J15  55.88,74.53 180 top
J16  55.88,38.58 180 top
JP1  67.31,8.89 0 top
JP2  41.91,40.64 0 top
JP3  71.9,61.2 0 top
JP4  60.96,8.89 0 top
JP5  77.47,8.89 0 top
JP6  83.82,8.89 0 top
JP7  67.31,17.78 180 top
JP8  60.96,17.78 180 top
JP9  83.82,17.78 180 top
JP10  77.47,17.78 180 top
JP11  105.41,3.81 0 top
JP12  13.97,17.78 180 top
JP13  13.97,10.16 0 top
JP14  3.81,78.74 0 top
JP20  34.29,17.78 180 top
JP21  34.29,8.89 0 top
JP22  27.94,17.78 180 top
JP23  27.94,8.89 0 top
JP24  50.8,17.78 180 top
JP25  44.45,8.89 0 top
JP26  44.45,17.78 180 top
JP27  50.8,8.89 0 top
L001  [LOGO-L]  77.47,12.86 0 bottom
L002  [LOGO-L]  67.31,12.86 0 bottom
L003  [LOGO-L]  83.82,12.86 0 bottom
L004  [LOGO-L]  60.96,12.86 0 bottom
LED1  62.48,36.58 0 top
LED2  42.07,52.07 270 top
LED3  40.64,52.07 270 top
LED4  49.29,52.07 90 top
LED5  51.99,52.07 90 top
LED6  50.64,52.07 90 top
LED7  45.24,52.07 90 top
LED8  47.94,52.07 90 top
LED9  46.59,52.07 90 top
LOGO1  39.13,73.34 0 bottom
LOGO2  32.62,76.2 0 bottom
LOGO4  8.26,66.04 90 bottom
LOGO5  8.26,40.64 90 bottom
LOGO6  55.88,46.36 0 bottom
R1  62.48,38.23 0 top
R2  61.09,43.94 270 top
R3  47.47,60.68 180 top
R4  55.9,69.69 90 top
R5  57.21,69.69 90 top
R6  43.58,51.99 90 top
R7  42.47,49.45 0 top
R8  49.29,49.29 270 top
R9  51.99,49.29 270 top
R10  50.64,49.29 270 top
R11  45.24,49.29 270 top
R12  47.94,49.29 270 top
R13  46.59,49.29 270 top
R14  58.26,51.44 270 top
R15  53.5,50.56 90 top
R16  56.04,49.29 0 top
R17  89.53,3.81 180 top
R24  13.97,63.5 0 top
R25  34.29,11.75 0 top
R26  27.94,11.75 0 top
R27  44.45,11.75 0 top
R28  50.8,11.75 0 top
R29  67.31,11.75 0 top
R30  60.96,11.75 0 top
R31  77.47,11.75 0 top
R32  83.82,11.75 0 top
S1  68.2,46.99 90 top
S2  43.82,56.9 180 top
S3  97.79,13.34 270 top
S4  13.97,13.97 0 top
SEWTAPLS+  10.16,72.64 210 top
SEWTAPLS-  10.16,59.44 330 top
SEWTAPLSOUT  21.59,66.04 90 top
SLIDEOFF  97.79,8.13 0 top
SLIDEON  97.79,18.54 180 top
ST1  6.35,66.04 270 top
ST2  17.78,59.44 30 top
ST3  17.78,72.64 150 top
TP1  49.53,66.04 0 bottom
TP2  52.07,68.58 0 bottom
TP3  52.07,66.04 0 bottom
TP4  54.61,66.04 0 bottom
TP5  54.61,68.58 0 bottom
TP6  49.53,68.58 0 bottom
TP7  66.67,41.16 0 bottom
TP8  69.22,46.99 0 bottom
U1  63.5,40.64 90 top
U2  70.48,52.83 270 top
U3  13.97,66.04 0 top
U5  60.96,60.96 0 top
U$1  55.88,54.25 0 bottom
U$3  [PETAL_PAD_OFF]  46.93,72.17 294 top
U$5  LILYLOGO_SHORT  [LILYPAD-WEARABLES_LOGO-LILYPAD]  13.61,66.04 90 bottom
U$6  LILYLOGO_SHORT  [LILYPAD-WEARABLES_LOGO-LILYPAD]  13.61,40.64 90 bottom
U$7  [PETAL_SPACE_OFF]  46.93,72.17 294 top
U$8  [PETAL_SPACE_OFF]  74.93,41.07 150 top
U$9  [PETAL_PAD_OFF]  74.93,41.07 150 top
U$10  [PETAL_SPACE_OFF]  76.8,58.87 198 top
U$11  [PETAL_PAD_OFF]  76.8,58.87 198 top
U$12  [PETAL_SPACE_OFF]  77.76,49.77 174 top
U$13  51.06,65.39 0 top
U$15  [PETAL_PAD_OFF]  77.76,49.77 174 top
U$16  [PETAL_SPACE_OFF]  72.23,66.79 222 top
U$17  [PETAL_PAD_OFF]  72.23,66.79 222 top
U$18  [PETAL_SPACE_OFF]  51.31,30.55 78 top
U$19  [PETAL_PAD_OFF]  42.95,34.27 54 top
U$20  [PETAL_SPACE_OFF]  42.95,34.27 54 top
U$21  [PETAL_PAD_OFF]  51.31,30.55 78 top
U$22  [PETAL_SPACE_OFF]  60.45,30.55 102 top
U$23  [PETAL_PAD_OFF]  60.45,30.55 102 top
U$24  [PETAL_SPACE_OFF]  68.81,34.27 126 top
U$25  [PETAL_PAD_OFF]  68.81,34.27 126 top
U$26  [PETAL_SPACE_OFF]  39.53,66.79 318 top
U$27  [PETAL_PAD_OFF]  39.53,66.79 318 top
U$28  [PETAL_SPACE_OFF]  34.96,58.87 342 top
U$29  [PETAL_PAD_OFF]  34.96,58.87 342 top
U$30  [PETAL_SPACE_OFF]  34,49.77 6 top
U$31  [PETAL_PAD_OFF]  34,49.77 6 top
U$32  [PETAL_SPACE_OFF]  36.83,41.07 30 top
U$33  [PETAL_PAD_OFF]  36.83,41.07 30 top
U$34  [PETAL_PAD_OFF]  64.83,72.17 246 top
U$35  10.22,47.14 210 top
U$36  21.47,40.64 90 top
U$37  17.72,34.14 30 top
U$38  10.22,34.14 330 top
U$39  17.72,47.13 150 top
U$40  6.47,40.64 270 top
U$41  99.69,40.64 0 top
U$42  99.69,48.26 0 top
U$43  34.8,74.93 0 top
U$44  3.81,-17.78 0 top  (outside the outline)
U$45  [LOGO-L]  13.97,13.97 90 bottom
U$46  [LOGO-L]  50.8,12.86 0 bottom
U$48  [LOGO-L]  44.45,12.86 0 bottom
U$49  [LOGO-L]  34.29,12.86 0 bottom
U$50  [LOGO-L]  27.94,12.86 0 bottom
U$51  [ROUTE_TICKS]  46.93,72.17 294 top
U$51/SDA  99.69,68.58 0 top
U$52  [ROUTE_TICKS]  39.53,66.79 318 top
U$52/SCL  99.69,58.42 0 top
U$52/SCL1  99.69,30.48 0 top
U$53  81.28,78.74 0 top
U$54  99.69,78.74 0 top
U$55  [ROUTE_TICKS]  34.96,58.87 342 top
U$56  [ROUTE_TICKS]  34,49.77 6 top
U$57  [ROUTE_TICKS]  36.83,41.07 30 top
U$58  [ROUTE_TICKS]  42.95,34.27 54 top
U$59  [ROUTE_TICKS]  51.31,30.55 78 top
U$60  [ROUTE_TICKS]  60.45,30.55 102 top
U$61  [ROUTE_TICKS]  68.81,34.27 126 top
U$62  [ROUTE_TICKS]  36.83,41.07 150 top
U$63  [ROUTE_TICKS]  77.76,49.77 174 top
U$64  [ROUTE_TICKS]  74.93,41.07 150 top
U$65  [ROUTE_TICKS]  76.8,58.87 198 top
U$66  [ROUTE_TICKS]  64.83,72.17 246 top
U$67  [ROUTE_TICKS]  72.23,66.79 222 top
U$68  [ROUTE_TICKS]  17.26,46.34 240 top
U$70  [ROUTE_TICKS]  10.67,34.92 60 top
U$71  [ROUTE_TICKS]  19.69,37.37 150 top
U$73  97.51,13.06 90 bottom
Y1  61.34,53.09 180 top

### Tracks (layer width: path | path; a pad name or v marks a point on that pad's centre or on a via)
3.3V  (via drill 0.33, 0.33 pad 0.51, 0.38)
  Top 0.203: 48.26,57.94 39.69,57.94 38.81,57.07 38.81,54.05 39.92,52.95 LED3.A | LED3.A | LED3.A LED2.A | R3.1 48.32,60.9 48.26,60.96
  Top 0.254: C4.2 66.17,58.8 65.97,59 U5.24 | C4.2 | C2.2 58.22,55.9 58.42,56.1 58.98,56.1 59.48,56.61 U5.14 | 58.54,65.17 59.29,65.17 59.48,64.98 U5.42 | 58.54,65.17 57.43,66.28 v57.15,66.28 57.15,67.31 57.55,67.71 60.56,67.71 61.28,68.42 63.18,68.42 64.93,66.67 v64.93,66.6 | v64.93,66.6 64.93,66.36 63.42,64.85 U5.34 | C3.2 65.18,66.6 v64.93,66.6 | U5.44 58.5,65.13 58.54,65.17 | U5.6 55.19,60.96 C5.2 55.05,60.96 v53.85,60.96
  Top 0.305: J1.1 47.5,71.59 | C2.2 57.1,55.29 56.95,55.44 49.57,55.44 48.26,56.75 48.26,57.94 48.26,58.42 48.06,58.62 48.06,59.29 48.26,59.49 48.26,60.96 v48.26,63.63
  Top 0.406: J1.1 44.77,77.47 arc63 40.01,80.64 10.95,80.64 arc127 8.26,75.88 8.79,75.03 SEWTAPLS+.1 10.16,67.37 11.49,66.04 U3.C | U$41.P$1 99.69,44.45 | 99.69,44.45 U$42.P$1 U$42.P$2 | J11.1 83.03,49.21 arc-25 89.69,46.99 arc31 99.69,44.45
  Top 0.61: U2.5 72.32,53.78 72.64,54.1 | 72.64,54.1 72.64,54.83 C6.2 72.1,56.81 70.79,58.11 v70.14,58.11 69.86,58.11 69.37,57.63 67.47,57.63 66.98,58.11 C4.2 | 47.5,71.59 47.5,68.58 | 47.5,68.58 47.5,64.39 v48.26,63.63 | TP6.P$1 47.5,68.58 | J11.1 74.21,49.77 73.5,50.48 73.5,53.24 72.64,54.1
  Bottom 0.254: v53.85,60.96 53.85,61.93 56.01,64.09 56.01,65.45 56.83,66.28 v57.15,66.28
  Bottom 0.406: U$41.P$1 99.69,44.45 | 99.69,44.45 U$42.P$1 U$42.P$2 | 99.69,44.45 arc-31 89.69,46.99 arc25 83.03,49.21 J11.1 v80.54,49.48 | v45.87,74.75 J1.1 44.77,77.47 arc63 40.01,80.64 10.95,80.64 arc127 8.26,75.88 8.79,75.03 SEWTAPLS+.1 v9.27,74.19
  Bottom 0.61: v48.26,63.63 48.26,62.48 49.78,60.96 v53.85,60.96 | v70.14,58.11 70.14,62.07 69.8,62.41 69.8,63.69 68.69,64.8 67.79,64.8 66.67,65.91 66.67,66.17 66.25,66.6 v64.93,66.6
  other vias: 49.53,68.58
  pour Top: 99.69,51.44 109.22,51.44 109.22,37.47 99.69,37.47 99.69,39.37 98.43,40.64 98.43,48.26 99.69,49.53
  pour Bottom: 99.69,51.44 109.22,51.44 109.22,37.47 99.69,37.47 99.69,39.37 98.43,40.64 98.43,48.26 99.69,49.53
BG_LED0  (via drill 0.33)
  Top 0.203: R8.2 v49.29,47.78 | U5.38 61.46,65.67 v61.67,65.88
  Bottom 0.203: v61.67,65.88 61.44,66.12 61.12,66.12 59.81,64.81 59.81,62.51 56.59,59.29 56.59,57.94 53.66,55.01 51.75,55.01 49.29,52.55 v49.29,47.78
BG_LED1  (via drill 0.33)
  Top 0.203: R9.2 51.99,48.22 52.15,48.06 59.49,48.06 60.29,48.86 62.67,48.86 v62.87,48.66 | 62.46,56.48 v62.66,56.28 62.44,56.5 U5.20
  Bottom 0.203: v62.66,56.28 62.63,56.24 62.63,55.8 62.55,55.72 62.55,50.16 62.31,49.93 62.31,49.21 v62.87,48.66
BG_LED2  (via drill 0.33)
  Top 0.203: 63.75,56.26 v63.75,56.13 63.75,56.66 63.66,56.75 63.18,56.75 62.92,57.02 U5.21 | R10.2 50.64,47.86 50.88,47.62 59.69,47.62 60.48,48.42 62.07,48.42 62.55,47.94 63.34,47.94 63.66,48.26 63.66,49.29 63.42,49.53 v63.1,49.53
  Bottom 0.203: v63.75,56.13 63.02,55.4 63.02,49.61 v63.1,49.53
BG_LED3  (via drill 0.33, 0.38)
  Top 0.203: R11.2 45.24,47.9 v45.36,47.78 | 57.71,64.82 v57.71,64.85 56.99,64.14 56.99,63.54 57.11,63.42 U5.1
  Bottom 0.203: v57.71,64.85 57.71,63.1 54.61,60.01 54.61,58.82 52.78,56.99 50.64,56.99 45.36,51.71 v45.36,47.78
BG_LED4  (via drill 0.33)
  Top 0.203: v60.17,66.91 60.17,65.6 60.46,65.31 U5.40 | R12.2 v47.94,47.78
  Bottom 0.203: v60.17,66.91 60.17,65.8 59.37,65.01 59.37,62.75 56.09,59.47 56.09,58.12 53.48,55.52 51.45,55.52 47.94,52.01 v47.94,47.78
BG_LED5  (via drill 0.33)
  Top 0.203: v59.29,66.12 59.29,65.8 59.98,65.11 U5.41 | R13.2 46.59,48.02 v46.83,47.78
  Bottom 0.203: v46.83,47.78 46.83,51.66 51.2,56.02 53.23,56.02 55.58,58.37 55.58,59.64 58.94,63 58.94,65.76 v59.29,66.12
D2  (via drill 0.33, 0.33 pad 0.51)
  Top 0.203: v61.83,47.7 60.4,47.7 59.81,47.11 44.65,47.11 43.82,47.94 v43.82,47.98 | U5.25 66.45,59.48 v66.61,59.64
  Top 0.406: R24.2 14.72,63.5 U3.E SEWTAPLSOUT.1 v23.39,66.04 24.13,66.04 arc63 26.19,67.31 arc-24 28.89,70.64 arc-51 32.86,71.6 arc-30 35.72,70.17 J2.1
  Bottom 0.203: v66.61,59.64 66.31,59.64 66.12,59.45 64.61,59.45 61.83,56.67 61.83,50.24 61.75,50.16 61.75,47.78 v61.83,47.7
  Bottom 0.305: v43.82,47.98 43.54,48.26 40.64,48.26 40.64,52.07 41.91,53.34 41.91,64.25 39.55,66.61 J2.1
  Bottom 0.406: SEWTAPLSOUT.1 v23.39,66.04 24.13,66.04 arc63 26.19,67.31 arc-24 28.89,70.64 arc-51 32.86,71.6 arc-30 35.72,70.17 39.18,67.1 | 39.18,67.1 J2.1 | v37.44,68.63 39.18,67.1
D3  (via drill 0.33, 0.33 pad 0.51)
  Top 0.203: 37.59,59.56 36.89,58.86 J3.1 | v62.23,67.63 62.55,67.94 63.02,67.94 63.82,67.15 63.82,65.88 63.18,65.25 62.71,65.25 62.44,64.98 U5.36
  Top 0.305: v47.24,63.25 46.07,63.25 44.09,61.26 41.47,61.26 39.77,59.56 37.59,59.56 | U$39.1 15.75,43.73 14.88,43.73 | 13.97,43.73 14.88,43.73 | 13.86,44.75 B1.+ 14.88,43.73
  Top 0.406: J3.1 30.48,60.33 arc78 23.02,58.1 arc19 20.64,53.02 arc-14 19.37,50.01 U$39.1
  Bottom 0.203: v47.24,63.25 47.24,62.36 49.32,60.28 54.19,60.28 56.83,62.93 56.83,65.25 57.07,65.48 57.47,65.48 58.04,66.06 58.04,66.61 59.61,68.18 61.67,68.18 v62.23,67.63
  Bottom 0.406: J3.1 34.49,59.02 | 34.49,59.02 30.48,60.33 arc78 23.02,58.1 arc19 20.64,53.02 arc-14 19.37,50.01 U$39.1 v18.59,48.69 | v32.31,59.74 34.49,59.02
D4  (via drill 0.33, 0.33 pad 0.51)
  Top 0.203: v67.07,60.8 66.83,61.04 65.09,61.04 65.01,60.96 U5.28 | v42.47,46.36 42.86,46.36 43.02,46.2 60.21,46.2 60.4,46.4 v60.92,46.4
  Top 0.406: JP12.1 v13.97,21.31 13.97,22.38 arc-67 14.61,23.34 arc8 21.43,26.51 arc36 28.42,33.97 arc-32 31.91,38.26 J5.1 | JP12.1 12.95,18.03 11.43,16.51 11.43,16.13 S4.1 | JP12.1 14.99,18.03 16.51,16.51 16.51,16.13 S4.2
  Bottom 0.203: v67.07,60.8 66.87,61 64.73,61 60.88,57.15 60.88,50.72 60.72,50.56 60.72,48.5 60.56,48.34 60.56,46.75 v60.92,46.4
  Bottom 0.305: J5.1 38.71,42.94 40.88,42.94 42.47,44.53 v42.47,46.36
  Bottom 0.406: 13.97,19.3 v13.97,21.31 | JP12.1 13.97,22.38 arc-67 14.61,23.34 arc8 21.43,26.51 arc36 28.42,33.97 arc-32 31.91,38.26 J5.1 v34.42,39.67
D5  (via drill 0.33, 0.33 pad 0.51)
  Top 0.203: v61.36,66.91 61.36,66.6 60.96,66.2 U5.39 | v43.56,43.09 43.58,43.1 43.58,43.74 43.89,44.05 45.09,44.05 46.08,45.05 v46.08,45.48
  Top 0.406: D3.A 32.79,16.28 JP20.1 v34.29,19.58 34.29,21.11 arc72 33.02,22.86 | D4.A 26.44,16.28 JP22.1 v27.94,19.58 27.94,21.11 arc-72 29.21,22.86 arc-36 33.02,22.86 | J6.1 40.01,30.16 arc-28 36.83,27.46 arc48 33.02,22.86
  Bottom 0.203: v61.36,66.91 60.56,67.71 59.85,67.71 58.5,66.36 58.5,63.26 55.09,59.85 55.09,58.58 53.02,56.52 50.88,56.52 46.08,51.71 v46.08,45.48
  Bottom 0.305: J6.1 44.45,35.78 44.45,40.64 43.56,41.53 v43.56,43.09
  Bottom 0.406: JP22.1 27.94,21.11 arc-72 29.21,22.86 arc-36 33.02,22.86 | JP20.1 34.29,21.11 arc72 33.02,22.86 | 33.02,22.86 arc-48 36.83,27.46 arc28 40.01,30.16 J6.1 v41.3,32
D6  (via drill 0.33, 0.33 pad 0.51)
  Top 0.203: v47.9,45.52 46.51,44.13 45.91,44.13 v44.96,43.18 | v56.47,56.83 57.82,56.83 57.98,56.99 58.34,56.99 58.5,57.15 U5.12
  Top 0.406: D6.A 49.3,16.28 JP24.1 v50.8,19.58 50.8,21.11 arc72 49.53,22.86 | D5.A 42.95,16.28 JP26.1 v44.45,19.56 44.45,21.11 arc-72 45.72,22.86 arc-36 49.53,22.86 | J7.1 50.17,25.4 arc-3 49.53,22.86
  Bottom 0.203: v56.47,56.83 56.19,56.83 53.9,54.53 52.07,54.53 50.17,52.63 50.17,46.59 49.09,45.52 v47.9,45.52
  Bottom 0.305: J7.1 51.31,36.83 50.01,38.14 48.5,38.14 44.96,41.68 v44.96,43.18
  Bottom 0.406: JP26.1 44.45,21.11 arc-72 45.72,22.86 arc-36 49.53,22.86 | JP24.1 50.8,21.11 arc72 49.53,22.86 | 49.53,22.86 arc3 50.17,25.4 J7.1 v50.7,27.81
D7  (via drill 0.33, 0.33 pad 0.51)
  Top 0.203: v62.23,45.96 61.95,45.68 60.52,45.68 60.48,45.72 49.02,45.72 v46.61,43.31 | U5.27 65.41,60.46 v65.58,60.29
  Top 0.406: D2.A 65.81,16.28 JP7.1 v67.31,19.58 67.31,21.11 arc72 66.04,22.86 arc36 62.23,22.86 | D7.A 59.46,16.28 JP8.1 v60.96,19.58 60.96,21.11 arc-72 62.23,22.86 | J8.1 61.44,25.88 arc6 62.23,22.86
  Bottom 0.203: v65.58,60.29 64.74,60.29 61.36,56.91 61.36,50.48 61.2,50.32 61.2,48.18 61.12,48.1 61.12,47.23 61.36,46.99 61.52,46.99 61.91,46.59 61.91,46.28 v62.23,45.96
  Bottom 0.305: J8.1 60.45,33.66 57.02,37.08 52.09,37.08 50.32,38.85 48.86,38.85 46.61,41.1 v46.61,43.31
  Bottom 0.406: JP8.1 60.96,21.11 arc-72 62.23,22.86 | JP7.1 67.31,21.11 arc72 66.04,22.86 arc36 62.23,22.86 | 62.23,22.86 arc-6 61.44,25.88 J8.1 v61.04,27.84
D8  (via drill 0.33, 0.33 pad 0.51)
  Top 0.203: v67.69,61.85 66.61,61.85 66.22,61.46 U5.29 | v59.29,45.05 59.09,45.24 49.25,45.24 47.62,43.62 v47.62,43.22
  Top 0.406: D9.A 82.32,16.28 JP9.1 v83.82,19.58 83.82,21.11 arc72 82.55,22.86 arc36 78.74,22.86 | D8.A 75.97,16.28 JP10.1 v77.47,19.58 77.47,21.11 arc-72 78.74,22.86 | J9.1 71.44,30.64 arc27 74.77,27.78 arc-48 78.74,22.86
  Bottom 0.203: v67.69,61.85 67.01,61.85 66.64,61.48 64.41,61.48 60.4,57.47 60.4,50.96 60.25,50.8 60.25,48.82 59.29,47.86 v59.29,45.05
  Bottom 0.305: J9.1 68.57,34.3 64.33,38.55 51.71,38.55 50.64,39.61 49.13,39.61 47.62,41.12 v47.62,43.22
  Bottom 0.406: JP10.1 77.47,21.11 arc-72 78.74,22.86 | JP9.1 83.82,21.11 arc72 82.55,22.86 arc36 78.74,22.86 | 78.74,22.86 arc48 74.77,27.78 arc-27 71.44,30.64 J9.1 v70.46,32
D9  (via drill 0.33, 0.33 pad 0.51)
  Top 0.203: v62.8,66.61 62.8,65.94 61.94,65.07 U5.37 | v48.62,43.24 49.93,44.55 v49.93,44.57
  Top 0.254: S3.1 96.22,15.84 96.59,16.2 96.59,17.62 96.61,17.62 SLIDEON.1 99.09,17.5 99.09,16.2 99.46,15.84 S3.4
  Top 0.406: J10.1 79.85,38.26 arc-23 85.45,32.86 arc56 93.42,28.65 95.29,28.65 | SLIDEON.1 97.79,24.13 arc58 97.35,24.92 arc-57 95.29,28.65 | U$52/SCL1.P$1 97.23,28.65 95.29,28.65
  Bottom 0.203: v62.8,66.61 62.8,65.9 60.25,63.34 60.25,62.23 57.07,59.05 57.07,57.27 57.15,57.19 57.15,56.28 56.59,55.72 55.8,55.72 54.13,54.05 52.31,54.05 50.72,52.47 50.72,45.36 v49.93,44.57
  Bottom 0.305: J10.1 73.57,42.42 70.5,42.42 67.44,39.35 52.05,39.35 51.08,40.32 49.45,40.32 48.62,41.16 v48.62,43.24
  Bottom 0.406: SLIDEON.1 97.79,24.13 arc58 97.35,24.92 arc-57 95.29,28.65 | 95.29,28.65 97.23,28.65 U$52/SCL1.P$1 U$52/SCL1.P$2 | 95.29,28.65 93.42,28.65 arc-56 85.45,32.86 arc23 79.85,38.26 J10.1 v77.37,39.67
  pour Top: 102.23,33.66 109.22,33.66 109.22,27.3 102.23,27.3
  pour Top (isolate 0.381): 101.6,15.88 101.6,18.03 100.46,18.67 99.31,19.05 98.43,19.3 96.9,19.3 95.76,18.92 94.62,18.29 93.98,17.91 93.98,15.88
  pour Bottom: 102.23,33.66 109.22,33.66 109.22,27.3 102.23,27.3
D10  (via drill 0.33, 0.33 pad 0.51)
  Top 0.203: v67.87,55.01 67.72,54.86 67.36,54.86 67.23,54.74 62.99,54.74 62.59,55.13 61.96,55.13 61.46,55.63 U5.18
  Top 0.305: J12.1 76.02,58.1 72.39,58.1 71.36,59.13 69.53,59.13 69.03,58.63 v67.95,58.63
  Top 0.406: U$52/SCL.P$2 U$52/SCL.P$1 arc3 94.69,58.42 arc-26 86.04,60.17 arc43 81.44,60.4 J12.1
  Bottom 0.203: v67.87,55.01 67.87,58.55 v67.95,58.63
  Bottom 0.406: U$52/SCL.P$2 U$52/SCL.P$1 arc3 94.69,58.42 arc-26 86.04,60.17 arc43 81.44,60.4 77.27,59.02 | J12.1 77.27,59.02 | v79.45,59.77 77.27,59.02
  pour Top: 102.23,61.59 109.22,61.59 109.22,55.24 102.23,55.24
  pour Bottom: 102.23,61.59 109.22,61.59 109.22,55.24 102.23,55.24
D11  (via drill 0.33, 0.33 pad 0.51)
  Top 0.203: v66.52,55.4 66.48,55.37 65.15,55.37 65.02,55.24 63.25,55.24 62.93,55.56 62.23,55.56 61.94,55.85 U5.19
  Top 0.305: J13.1 69.29,63.86 69.29,61.07 v68.02,59.8
  Top 0.406: U$51/SDA.P$2 U$51/SDA.P$1 92.15,68.58 arc-21 83.66,70.01 arc25 77.87,70.8 arc37 75.64,69.85 J13.1
  Bottom 0.203: v66.52,55.4 66.83,55.4 67.27,55.84 67.27,59.05 v68.02,59.8
  Bottom 0.406: J13.1 72.58,67.1 | 72.58,67.1 75.64,69.85 arc-37 77.87,70.8 arc-25 83.66,70.01 arc21 92.15,68.58 U$51/SDA.P$2 | v74.32,68.66 72.58,67.1
  pour Top: 102.23,71.75 109.22,71.75 109.22,65.41 102.23,65.41
  pour Bottom: 102.23,71.75 109.22,71.75 109.22,65.41 102.23,65.41
D+
  Top 0.203: R4.1 55.9,67.97 55.94,67.93 55.94,62.68 56.68,61.94 U5.4
D-
  Top 0.203: R5.1 57.21,68.41 56.4,67.59 56.4,62.98 56.94,62.44 U5.3
GND  (via drill 0.33, 0.33 pad 0.51)
  Top 0.203: C5.1 55.81,62.05 56.4,61.46 U5.5 | 59.05,63.12 59.05,61.46 58.79,61.46 | 62.96,63.46 62.96,61.47 58.8,61.47 | 59.93,55.4 59.98,55.46 U5.15 59.98,59.68 59.97,59.69
  Top 0.254: 65.28,58.17 64.94,58.5 U5.23 61.16,58.5 | 59.05,63.12 58.96,63.21 59,63.26 U5.43 | C2.1 59.82,55.29 59.93,55.4 | U5.35 62.92,63.5 62.96,63.46 63,63.42 U5.33 | U5.5 58.79,61.46 58.8,61.47 | v59.85,60.72 59.85,60.85 59.96,60.96
  Top 0.305: U$38.1 12.17,37.55 13.06,37.55 B1.-
  Top 0.406: J15.GND 54.55,69.66 54.61,69.6 | R29.1 66.04,11.75 66.04,10.16 JP1.1 v67.31,7.09 67.31,3.81 | R30.1 59.69,11.75 59.69,10.16 JP4.1 v60.96,7.09 60.96,3.81 | R31.1 76.2,11.75 76.2,10.16 JP5.1 v77.47,7.09 77.47,3.81 | R32.1 82.55,11.75 82.55,10.16 JP6.1 v83.82,7.09 83.82,3.81 | R28.1 49.53,11.75 49.53,10.16 JP27.1 v50.8,7.09 50.8,3.81 | R27.1 43.18,11.75 43.18,10.16 JP25.1 v44.45,7.11 44.45,3.81 | R26.1 26.67,11.75 26.67,10.16 JP23.1 v27.94,7.09 27.94,3.81 | R25.1 33.02,11.75 33.02,10.16 JP21.1 v34.29,7.09 34.29,3.81 | R24.1 11.43,63.5 10.16,62.23 SEWTAPLS-.1 8.67,56.88 4.4,49.7 arc31 1.27,38.34 1.27,22.7 | J14.1 66.81,76.53 arc-62 70.48,78.74 U$53.P$1 | J4.1 29.05,49.21 arc84 26.23,46.04 arc8 26.51,42.55 arc-49 23.18,30.8 arc-22 18.57,27.15 arc-11 9.21,23.65 | 83.82,3.81 77.47,3.81 | 77.47,3.81 67.31,3.81 | 67.31,3.81 60.96,3.81 | 60.96,3.81 50.8,3.81 | 50.8,3.81 44.45,3.81 | 44.45,3.81 34.29,3.81 | 34.29,3.81 27.94,3.81 | 27.94,3.81 13.97,3.81 | 13.97,3.81 5.4,3.81 arc-93 1.27,7.78 1.27,22.7 | JP13.1 v13.97,6.63 13.97,3.81 | 83.82,3.81 v87.67,3.81 R17.2 88.9,3.81 | v9.32,32.59 8.26,30.64 arc29 7.78,28.73 arc25 9.21,23.65 | 9.21,23.65 arc-16 1.27,22.7 | JP13.1 14.99,9.91 16.51,11.43 16.51,11.81 S4.4 | JP13.1 12.95,9.91 11.43,11.43 11.43,11.81 S4.3
  Top 0.61: J4.1 37.47,50.16 | J14.1 63.5,69.14
  Bottom 0.406: 13.97,6.35 v13.97,6.63 JP13.1 13.97,3.81 | U$53.P$1 70.48,78.74 arc62 66.81,76.53 J14.1 v65.99,74.73 | JP5.1 77.47,3.81 | JP1.1 67.31,3.81 | JP4.1 60.96,3.81 | JP25.1 44.45,3.81 | JP27.1 50.8,3.81 | JP21.1 34.29,3.81 | JP23.1 27.94,3.81 | 83.82,3.81 77.47,3.81 | 77.47,3.81 67.31,3.81 | 67.31,3.81 60.96,3.81 | 60.96,3.81 50.8,3.81 | 50.8,3.81 44.45,3.81 | 44.45,3.81 34.29,3.81 | 34.29,3.81 27.94,3.81 | 27.94,3.81 13.97,3.81 | 13.97,3.81 5.4,3.81 arc-93 1.27,7.78 1.27,22.7 | 83.82,3.81 JP6.1 | 83.82,3.81 v87.67,3.81 | 1.27,22.7 1.27,38.34 arc-31 4.4,49.7 8.67,56.88 SEWTAPLS-.1 v9.25,57.89 | 9.21,23.65 arc11 18.57,27.15 arc22 23.18,30.8 arc49 26.51,42.55 arc-8 26.23,46.04 arc-84 29.05,49.21 J4.1 v31.22,49.45 | 9.21,23.65 arc-16 1.27,22.7 | 9.21,23.65 arc-25 7.78,28.73 arc-29 8.26,30.64 v9.32,32.59 U$38.1
  Bottom 0.61: J4.1 37.47,50.16
  other vias: 54.61,68.58 58.66,69.37 57.75,57.63 65.01,57.63 61.52,63.1 50.96,57.78 50.17,59.37 44.77,54.37 40.08,56.28 38.66,52.47 42.23,42.31 56.91,42.07 58.74,44.13 68.18,44.13 63.66,45.88 55.8,54.65 64.45,53.82 70.33,56.67 70.56,50.88
  pour Top (isolate 0.305): 81.28,52.07 arc90 55.88,77.47 arc90 30.48,52.07 arc90 55.88,26.67 arc90
  pour Bottom (isolate 0.305): 81.28,52.07 arc90 55.88,77.47 arc90 30.48,52.07 arc90 55.88,26.67 arc90
  pour Top: 78.11,78.74 arc90 81.28,75.56 109.22,75.56 109.22,79.38 arc90 106.05,82.55 78.11,82.55
  pour Bottom: 78.11,78.74 arc90 81.28,75.56 109.22,75.56 109.22,79.38 arc90 106.05,82.55 78.11,82.55
MISO  (via drill 0.33)
  Top 0.203: 49.53,65.91 TP1.P$1 50.96,64.61 50.96,61.52 51.2,61.28 51.2,58.74 52.07,57.86 53.58,57.86 54.09,58.38 54.29,58.38 56.95,58.38 57.07,58.5 U5.11
  other vias: 49.53,66.04
MOSI  (via drill 0.33)
  Top 0.203: TP2.P$1 52.07,67.39 51.2,66.52 51.2,65.56 51.4,65.36 51.4,61.71 51.63,61.48 51.63,58.94 52.27,58.3 53.38,58.3 53.9,58.82 56.75,58.82 56.9,58.96 56.94,59 U5.10
  other vias: 52.07,68.58
N$1
  Top 0.203: LED2.C 42.12,51.14 R6.1
N$2  (via drill 0.33)
  Top 0.254: S1.2 67.95,46.99 68.38,47.43 | 68.38,47.43 69.09,48.13 69.09,49.66 68.33,50.42 68.33,51.56 68.65,51.88 U2.3 | 68.38,47.43 68.82,46.99 TP8.P$1
  other vias: 69.22,46.99
N$3
  Top 0.203: LED1.A 61.63,36.6 R1.1
N$4
  Top 0.254: LED1.C 64.01,36.58 64.52,37.08 64.52,38.1 65.53,39.12 65.53,39.5 65.34,39.69 U1.1
N$5
  Top 0.203: Y1.1 62.54,54.38 62.23,54.69 61.64,54.69 60.96,55.37 U5.17
N$6
  Top 0.254: R2.2 59.82,41.82 59.82,40.77 60.89,39.69 U1.5
N$7
  Top 0.203: Y1.3 60.14,54.27 60.46,54.59 U5.16
N$8
  Top 0.203: R16.1 55.46,49.47 56.61,50.61 D10.2
N$9
  Top 0.203: LED7.A R11.1
N$10
  Top 0.203: LED6.A R10.1
N$11
  Top 0.203: LED5.A R9.1
N$12
  Top 0.203: LED8.A R12.1
N$13
  Top 0.203: LED9.A R13.1
N$14
  Top 0.203: R15.1 54.47,49.98 D10.3
N$15
  Top 0.203: R14.1 56.9,52.29 56.61,52.58 D10.1
N$18
  Top 0.203: LED4.A R8.1
N$19
  Top 0.203: J15.D- 56.5,71.53 57.21,70.82 R5.2
N$20
  Top 0.203: R4.2 55.88,70.29 55.88,70.68 55.85,70.72 J15.D+
N$21
  Top 0.203: LED3.C 40.64,49.69 40.88,49.45 R7.1
N$41
  Top 0.406: D3.C 35.79,12.4 R25.2
N$42
  Top 0.406: D4.C 29.44,12.4 R26.2
N$43
  Top 0.406: R27.2 45.95,12.4 D5.C
N$44
  Top 0.406: D6.C 52.3,12.4 R28.2
N$45
  pour Top: 23.11,60.71 24.13,66.04 23.11,71.37 19.37,74.93 13.97,76.38 8.89,74.93 4.83,71.05 3.81,66.04 4.83,60.71 8.89,57.15 13.97,55.38 19.05,57.15
  pour Top: 23.11,35.31 24.13,40.64 23.11,45.97 19.37,49.53 13.97,50.98 8.89,49.53 4.83,45.65 3.81,40.64 4.83,35.31 8.89,31.75 13.97,29.98 19.05,31.75
N$46
  pour Bottom: 23.11,60.71 24.13,66.04 23.11,71.37 19.37,74.93 13.97,76.38 8.89,74.93 4.83,71.05 3.81,66.04 4.83,60.71 8.89,57.15 13.97,55.38 19.05,57.15
  pour Bottom: 23.11,35.31 24.13,40.64 23.11,45.97 19.37,49.53 13.97,50.98 8.89,49.53 4.83,45.65 3.81,40.64 4.83,35.31 8.89,31.75 13.97,29.98 19.05,31.75
RESET  (via drill 0.33)
  Top 0.203: S2.4 S2.3 46.62,58.82 R3.2 46.62,61.96 v46.48,62.1 | v49.02,58.94 49.02,56.78 49.85,55.96 57.39,55.96 57.55,56.12 57.75,56.12 58.2,56.57 58.6,56.57 59,56.97 U5.13
  Bottom 0.203: TP4.P$1 52.07,63.5 50.8,63.5 49.78,64.52 47.37,64.52 46.48,63.63 v46.48,62.1 46.48,59.48 47.02,58.94 v49.02,58.94
  other vias: 54.61,66.04
RGB_B  (via drill 0.33)
  Top 0.203: v66.04,63.63 65.53,63.63 64.82,62.92 U5.32 | R15.2 53.5,51.9 v53.88,52.28
  Bottom 0.203: v66.04,63.63 64.26,63.63 58.98,58.34 58.98,53.26 57.99,52.28 v53.88,52.28
RGB_G  (via drill 0.33)
  Top 0.203: v66.93,62.87 65.37,62.87 64.94,62.44 U5.31 | v57.71,49.29 R16.2
  Bottom 0.203: v66.93,62.87 64.29,62.87 59.45,58.02 59.45,52.94 57.71,51.2 v57.71,49.29
RGB_R  (via drill 0.33)
  Top 0.203: 65.61,61.96 v65.8,62.15 65.59,61.94 U5.30 | R14.2 59.37,50.59 v59.37,50.56
  Bottom 0.203: v65.8,62.15 64.37,62.15 59.93,57.71 59.93,52.63 59.37,52.07 v59.37,50.56
RX_LED  (via drill 0.33)
  Top 0.203: v43.82,55.4 43.58,55.17 R6.2 | v52.82,59.47 53.04,59.69 56.2,59.69 56.49,59.98 U5.8
  Bottom 0.203: v43.82,55.4 45.48,57.07 49.13,57.07 50.72,58.66 51.96,58.66 52.77,59.47 v52.82,59.47
SCK  (via drill 0.33)
  Top 0.203: TP3.P$1 51.83,65.8 51.83,61.91 52.07,61.67 52.07,59.13 52.47,58.74 53.18,58.74 53.7,59.25 56.48,59.25 56.7,59.48 U5.9
  other vias: 52.07,66.04
SEWTAP+1
  Bottom 0.406: 10.16,72.64 8.79,75.03
SINK1
  pour Top (isolate 0.381): 96.52,10.87 93.98,10.87 93.98,8.64 95.12,8 96.39,7.49 97.03,7.37 97.54,9.4
SINK2
  pour Top (isolate 0.381): 101.6,10.8 99.06,10.8 98.31,10.04 98.3,7.37 98.68,7.37 99.82,7.7 100.84,8.18 101.6,8.76
SW_CM  (via drill 0.33)
  Top 0.203: v91.4,3.81 91.28,3.81
  Top 0.254: S3.2 96.16,13.34 96.39,13.1 96.39,10.92 97.79,9.52 | S3.5 99.32,13.34 99.19,13.2 99.19,10.92 97.79,9.52 | 97.79,9.52 SLIDEOFF.1
  Top 0.406: SLIDEOFF.1 97.79,3.02 arc-59 97,2.06 arc-54 93.82,2.86 arc41 91.28,3.81 R17.1
  pour Top (isolate 0.381): 101.6,14.86 93.98,14.86 93.98,11.81 101.6,11.81
SW_CM1
  Bottom 0.406: 97.79,7.87 97.79,3.02 arc-59 97,2.06 arc-54 93.82,2.86 arc41 91.28,3.81 91.3,3.81
TX_LED  (via drill 0.33)
  Top 0.203: v64.9,56.26 63.98,57.18 63.6,57.18 63.42,57.37 U5.22 | v63.58,47.23 63.34,46.99 61.48,46.99 61.36,47.11 60.44,47.11 60.01,46.67 43.97,46.67 43.1,47.55 43.1,48.38 43.5,48.78 43.5,49.27 R7.2
  Bottom 0.203: v64.9,56.26 64.9,55.93 64.45,55.48 64.06,55.48 63.5,54.93 63.5,50.16 63.82,49.85 63.82,49.13 63.58,48.9 v63.58,47.23
V_BATT  (via drill 0.33)
  Top 0.61: 48.26,39.12 49.91,39.12 53.07,42.28 J16.2 54.88,43.5 v54.91,43.53 | 48.26,39.12 44.83,39.12 43.94,40.01 43.94,41.15 44.32,41.53 D1.A | U1.3 66.24,41.59 TP7.P$1 | C8.2 48.36,39.01 48.26,39.12
  Bottom 0.61: v54.91,43.53 55.34,43.1 61.67,43.1 63.63,41.15 66.67,41.15 TP7.P$1
  other vias: 66.67,41.16
VCC_1  (via drill 0.33)  (1 unrouted)
  Top 0.203: v52.58,62.23 53.02,61.79 53.02,60.72 53.62,60.13 55.88,60.13 56.21,60.46 | U5.7 56.21,60.46 | 56.21,60.46
  Top 0.254: R1.2 63.5,38.39 63.5,40.13 62.74,40.89 62.74,41.4 62.55,41.59 U1.4 | 65.33,44.45 S1.1
  Top 0.406: U2.1 67.24,53.78 v67.18,53.72 | J15.VBUS 57.15,71.88 57.57,71.45 59.67,71.45 59.82,71.31 C7.2
  Top 0.61: D1.C 50.8,41.53 51.31,42.04 51.31,42.93 v52.07,43.69 | v60.83,41.27 61.15,41.59 U1.4 | 62.55,41.59 62.55,43.5 63.5,44.45 64.77,44.45 | 64.77,44.45 65.33,44.45 | S1.1 64.81,44.49 64.77,44.45
  Bottom 0.254: v52.58,62.23 52.58,62.36 55.37,65.15 55.37,65.66 56.93,67.22 57.94,67.22 60.3,69.57 60.68,69.57
  Bottom 0.61: v52.07,43.69 52.83,43.69 53.12,43.4 53.12,42.64 54.74,41.02 60.58,41.02 v60.83,41.27 | S1.1 65.91,45.03 65.91,49.28 67.18,50.55 v67.18,53.72 68.01,53.72 68.98,54.69 68.98,58.42 69.14,58.58 69.14,61.44 68.74,61.83 68.74,63.26 68.18,63.82 67.39,63.82 66.28,64.93 65.09,64.93 63.9,66.12 63.9,67.39 62.39,68.9 61.36,68.9 60.68,69.57 59.82,70.44 v59.82,71.35
  other vias: 65.37,44.49
X003
  Top 0.406: D2.C 68.81,12.4 R29.2
X004
  Top 0.406: D7.C 62.46,12.4 R30.2
X005
  Top 0.406: R31.2 78.97,12.4 D8.C
X006
  Top 0.406: D9.C 85.32,12.4 R32.2

### Text on the board
Bottom: v10
Dimension: ROUTE OUT | ROUTE OUT | ROUTE OUT | ROUTE OUT | ROUTE OUT | ROUTE OUT | ROUTE OUT | ROUTE OUT | ROUTE OUT | ROUTE OUT | ROUTE OUT | ROUTE OUT | ROUTE OUT | ROUTE OUT | ROUTE OUT | ROUTE OUT | ROUTE OUT | ROUTE OUT | ROUTE OUT | ROUTE OUT | ROUTE OUT | ROUTE OUT | ROUTE OUT | ROUTE OUT | ROUTE OUT | ROUTE OUT | ROUTE OUT | ROUTE OUT | ROUTE OUT | ROUTE OUT | ROUTE OUT | ROUTE OUT | ROUTE OUT | ROUTE OUT | ROUTE OUT
tPlace: - | + | + | + | - | S | - | A2 | 11 | SDA | RESET | R:12 | A3 | ~10 | G:13 | SCL | B:14 | - | OFF/CHG | - | + | 15 | 16 | 17 | 18 | 19 | 20 | + | TX | RX | + | A4 | ON | A9 | A5 | ~A8 | - | CHG | ~6 | ~A7 | - | On | + | + | + | + | + | + | + | + | - | - | - | - | - | - | - | - | Off | -
bPlace: - | + | + | - | S | A2 | 11 | - | SDA | Light Sensor | A3 | ~10 | SCL | - | + | + | A4 | A9 | Buzzer | A5 | ~A8 | ~6 | ~A7 | + | + | + | + | + | + | + | + | Yellow | Yellow | Red | Red | Green | Green | Blue | Blue | Button | - | - | - | - | - | - | - | - | Switch
tNames: U3
tDocu: Marshall Taylor | LilyPad concept and shapes by: L. Buechly and N. Seidle | PCB thickness: 31 mil / 0.8mm | Solder mask color: Purple (Lilypad) | Finishing: Lead-free HASL | 0.015 inch holes NPTH | 0.020 inch holes NPTH | All other holes PTH